# EAGLE design CCM_0001 (EAGLE 6.5.0)
Unipolar (6 wire) stepper motor driver

## Sheet 1 of 6: PIC
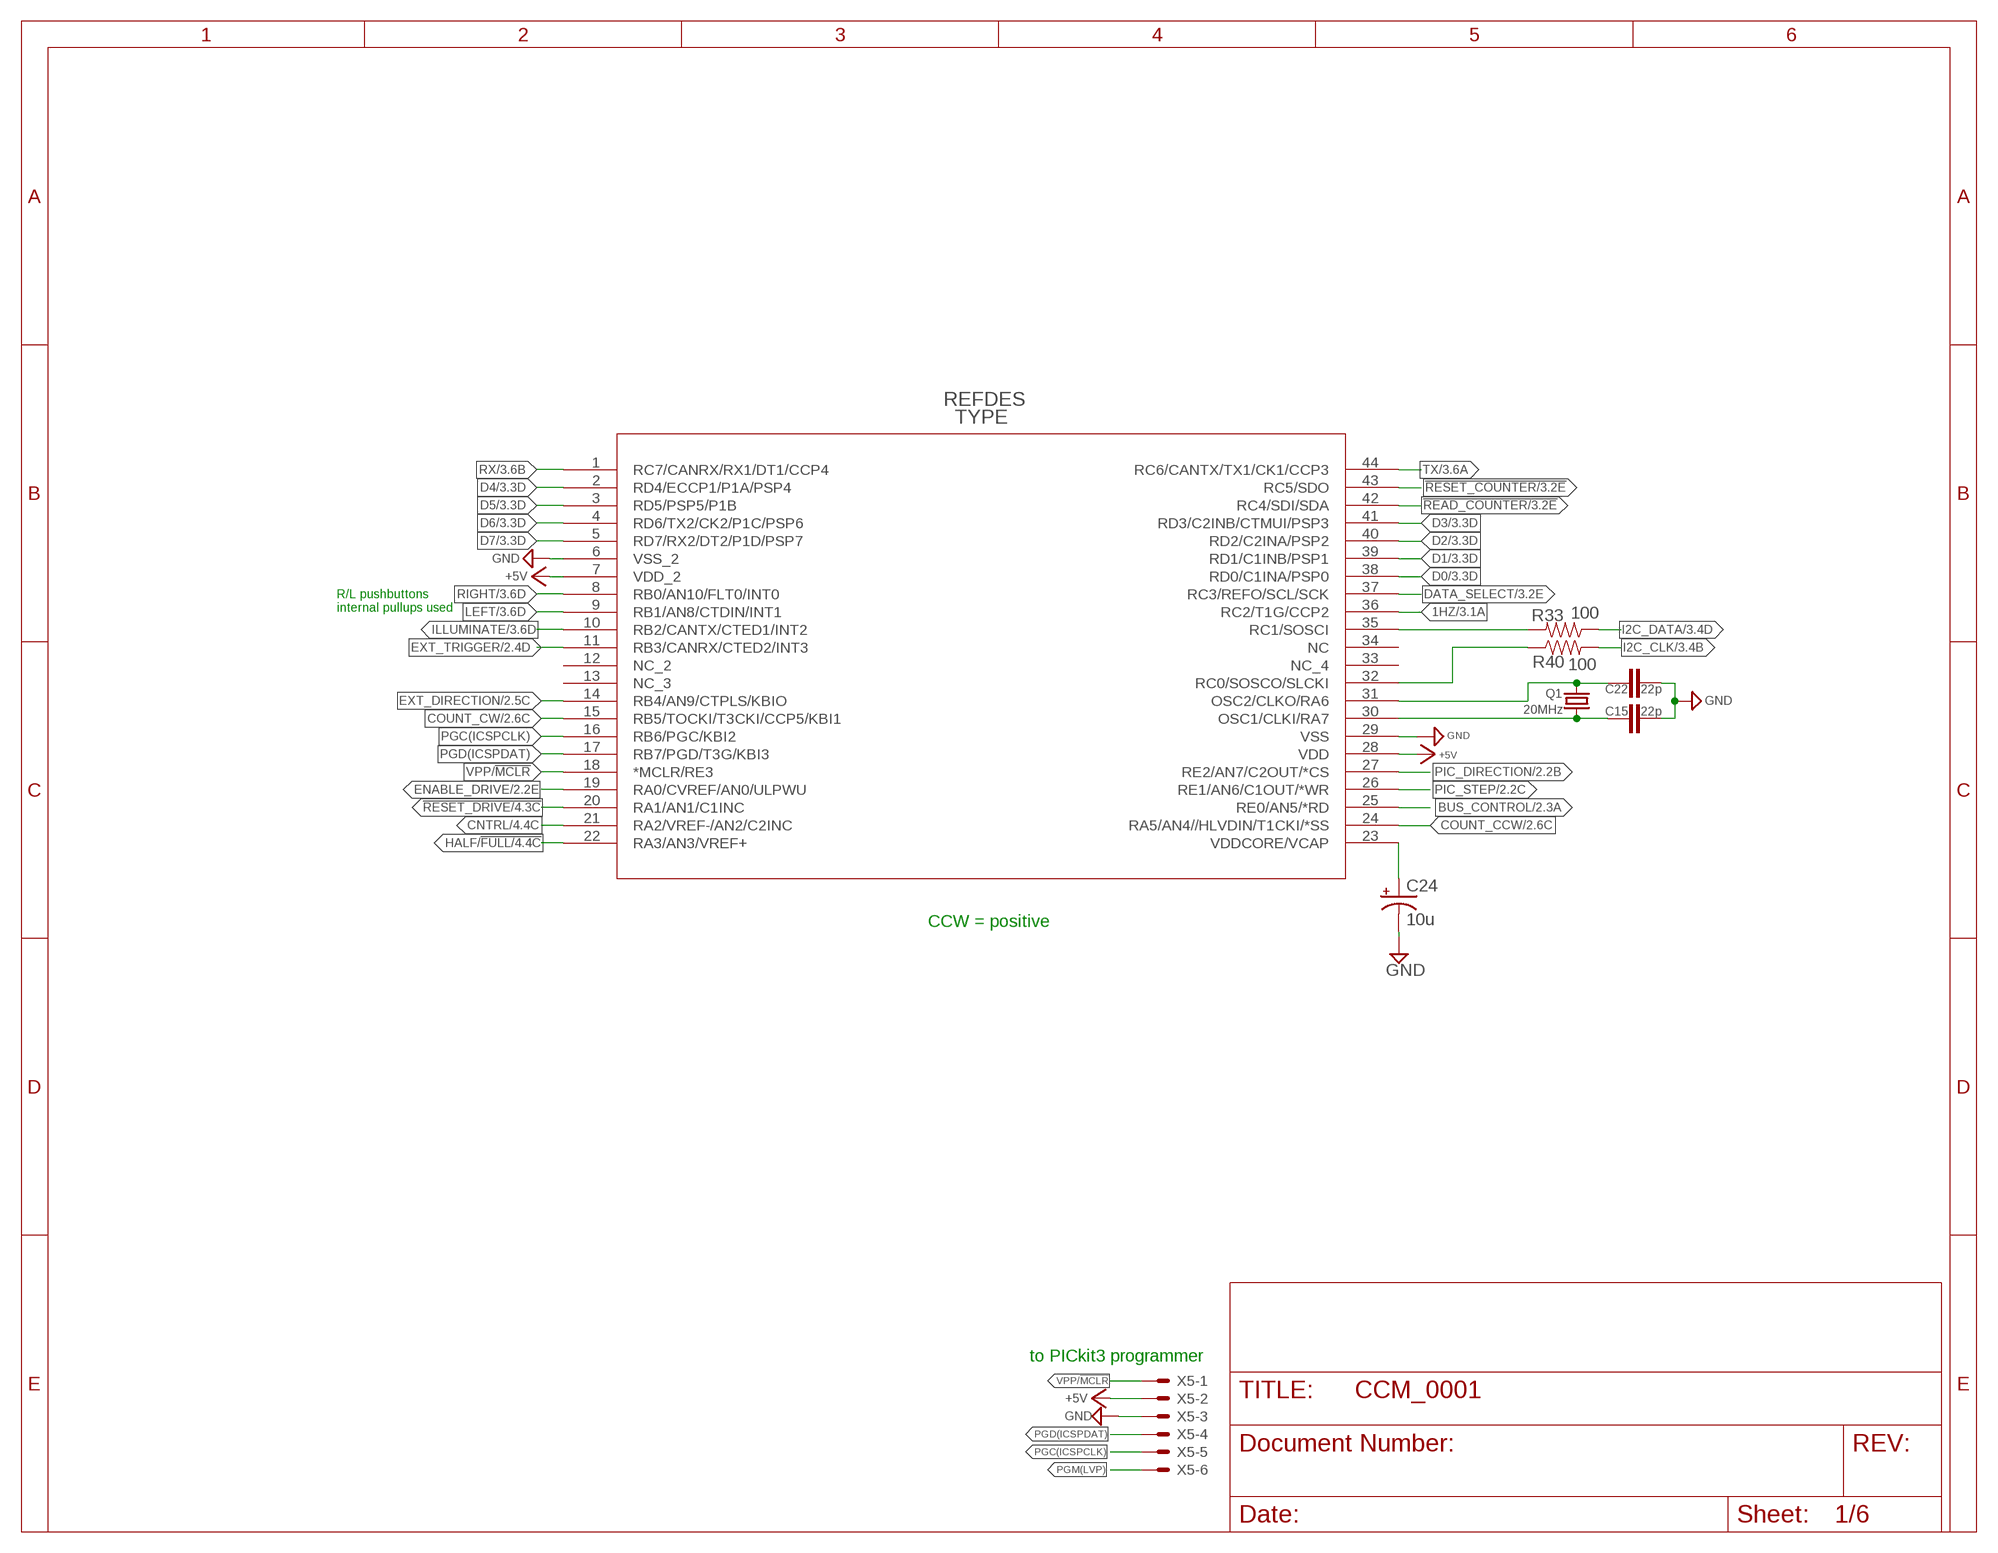
[diagram p0: schematic, sheet 1]

### Parts
C15  22p  CAP0603-CAP  [0603-CAP]
C22  22p  CAP0603-CAP  [0603-CAP]
C24  10u  CAP_POL1206  [EIA3216]
IC18  PIC18F46K80  [TQFP44_MC]
Q1  20MHz  CRYSTALTC26V  [TC26V]
R33  100  RESISTOR0603-RES  [0603-RES]
R40  100  RESISTOR0603-RES  [0603-RES]
X5  22-23-2061  [22-23-2061]

### Nets
1HZ: IC18.36(RC2/T1G/CCP2) ; also sheet 3
!READ_COUNTER: IC18.42(RC4/SDI/SDA) ; also sheet 3
!RESET_COUNTER: IC18.43(RC5/SDO) ; also sheet 3
!RESET_DRIVE: IC18.20(RA1/AN1/C1INC) ; also sheet 4
+5V: IC18.7(VDD_2) IC18.28(VDD) X5.2 ; also sheet 2,3,4,6
BUS_CONTROL: IC18.25(RE0/AN5/*RD) ; also sheet 2
CNTRL: IC18.21(RA2/VREF-/AN2/C2INC) ; also sheet 4
COUNT_CCW: IC18.24(RA5/AN4//HLVDIN/T1CKI/*SS) ; also sheet 2
COUNT_CW: IC18.15(RB5/TOCKI/T3CKI/CCP5/KBI1) ; also sheet 2
D0: IC18.38(RD0/C1INA/PSP0) ; also sheet 3
D1: IC18.39(RD1/C1INB/PSP1) ; also sheet 3
D2: IC18.40(RD2/C2INA/PSP2) ; also sheet 3
D3: IC18.41(RD3/C2INB/CTMUI/PSP3) ; also sheet 3
D4: IC18.2(RD4/ECCP1/P1A/PSP4) ; also sheet 3
D5: IC18.3(RD5/PSP5/P1B) ; also sheet 3
D6: IC18.4(RD6/TX2/CK2/P1C/PSP6) ; also sheet 3
D7: IC18.5(RD7/RX2/DT2/P1D/PSP7) ; also sheet 3
DATA_SELECT: IC18.37(RC3/REFO/SCL/SCK) ; also sheet 3
ENABLE_DRIVE: IC18.19(RA0/CVREF/AN0/ULPWU) ; also sheet 2,4
EXT_DIRECTION: IC18.14(RB4/AN9/CTPLS/KBIO) ; also sheet 2
EXT_TRIGGER: IC18.11(RB3/CANRX/CTED2/INT3) ; also sheet 2
GND: C15.1 C22.1 C24.C(-) IC18.6(VSS_2) IC18.29(VSS) X5.3 ; also sheet 2,3,4,5,6
HALF/!FULL: IC18.22(RA3/AN3/VREF+) ; also sheet 4
I2C_CLK: R40.2 ; also sheet 3
I2C_DATA: R33.1 ; also sheet 3
ILLUMINATE: IC18.10(RB2/CANTX/CTED1/INT2) ; also sheet 3
LEFT: IC18.9(RB1/AN8/CTDIN/INT1) ; also sheet 3
N$4: C15.2 IC18.30(OSC1/CLKI/RA7) Q1.1
N$10: C22.2 IC18.31(OSC2/CLKO/RA6) Q1.2
N$12: C24.A(+) IC18.23(VDDCORE/VCAP)
N$20: IC18.35(RC1/SOSCI) R33.2
N$43: IC18.32(RC0/SOSCO/SLCKI) R40.1
PGC(ICSPCLK): IC18.16(RB6/PGC/KBI2) X5.5
PGD(ICSPDAT): IC18.17(RB7/PGD/T3G/KBI3) X5.4
PGM(LVP): X5.6
PIC_DIRECTION: IC18.27(RE2/AN7/C2OUT/*CS) ; also sheet 2
PIC_STEP: IC18.26(RE1/AN6/C1OUT/*WR) ; also sheet 2
RIGHT: IC18.8(RB0/AN10/FLT0/INT0) ; also sheet 3
RX: IC18.1(RC7/CANRX/RX1/DT1/CCP4) ; also sheet 3
TX: IC18.44(RC6/CANTX/TX1/CK1/CCP3) ; also sheet 3
VPP/!MCLR: IC18.18(*MCLR/RE3) X5.1
Unconnected: IC18.12(NC_2) IC18.13(NC_3) IC18.33(NC_4) IC18.34(NC)

### Notes on the sheet
- R/L pushbuttons
  internal pullups used
- CCW = positive
- to PICkit3 programmer

## Sheet 2 of 6: Inputs/Outputs
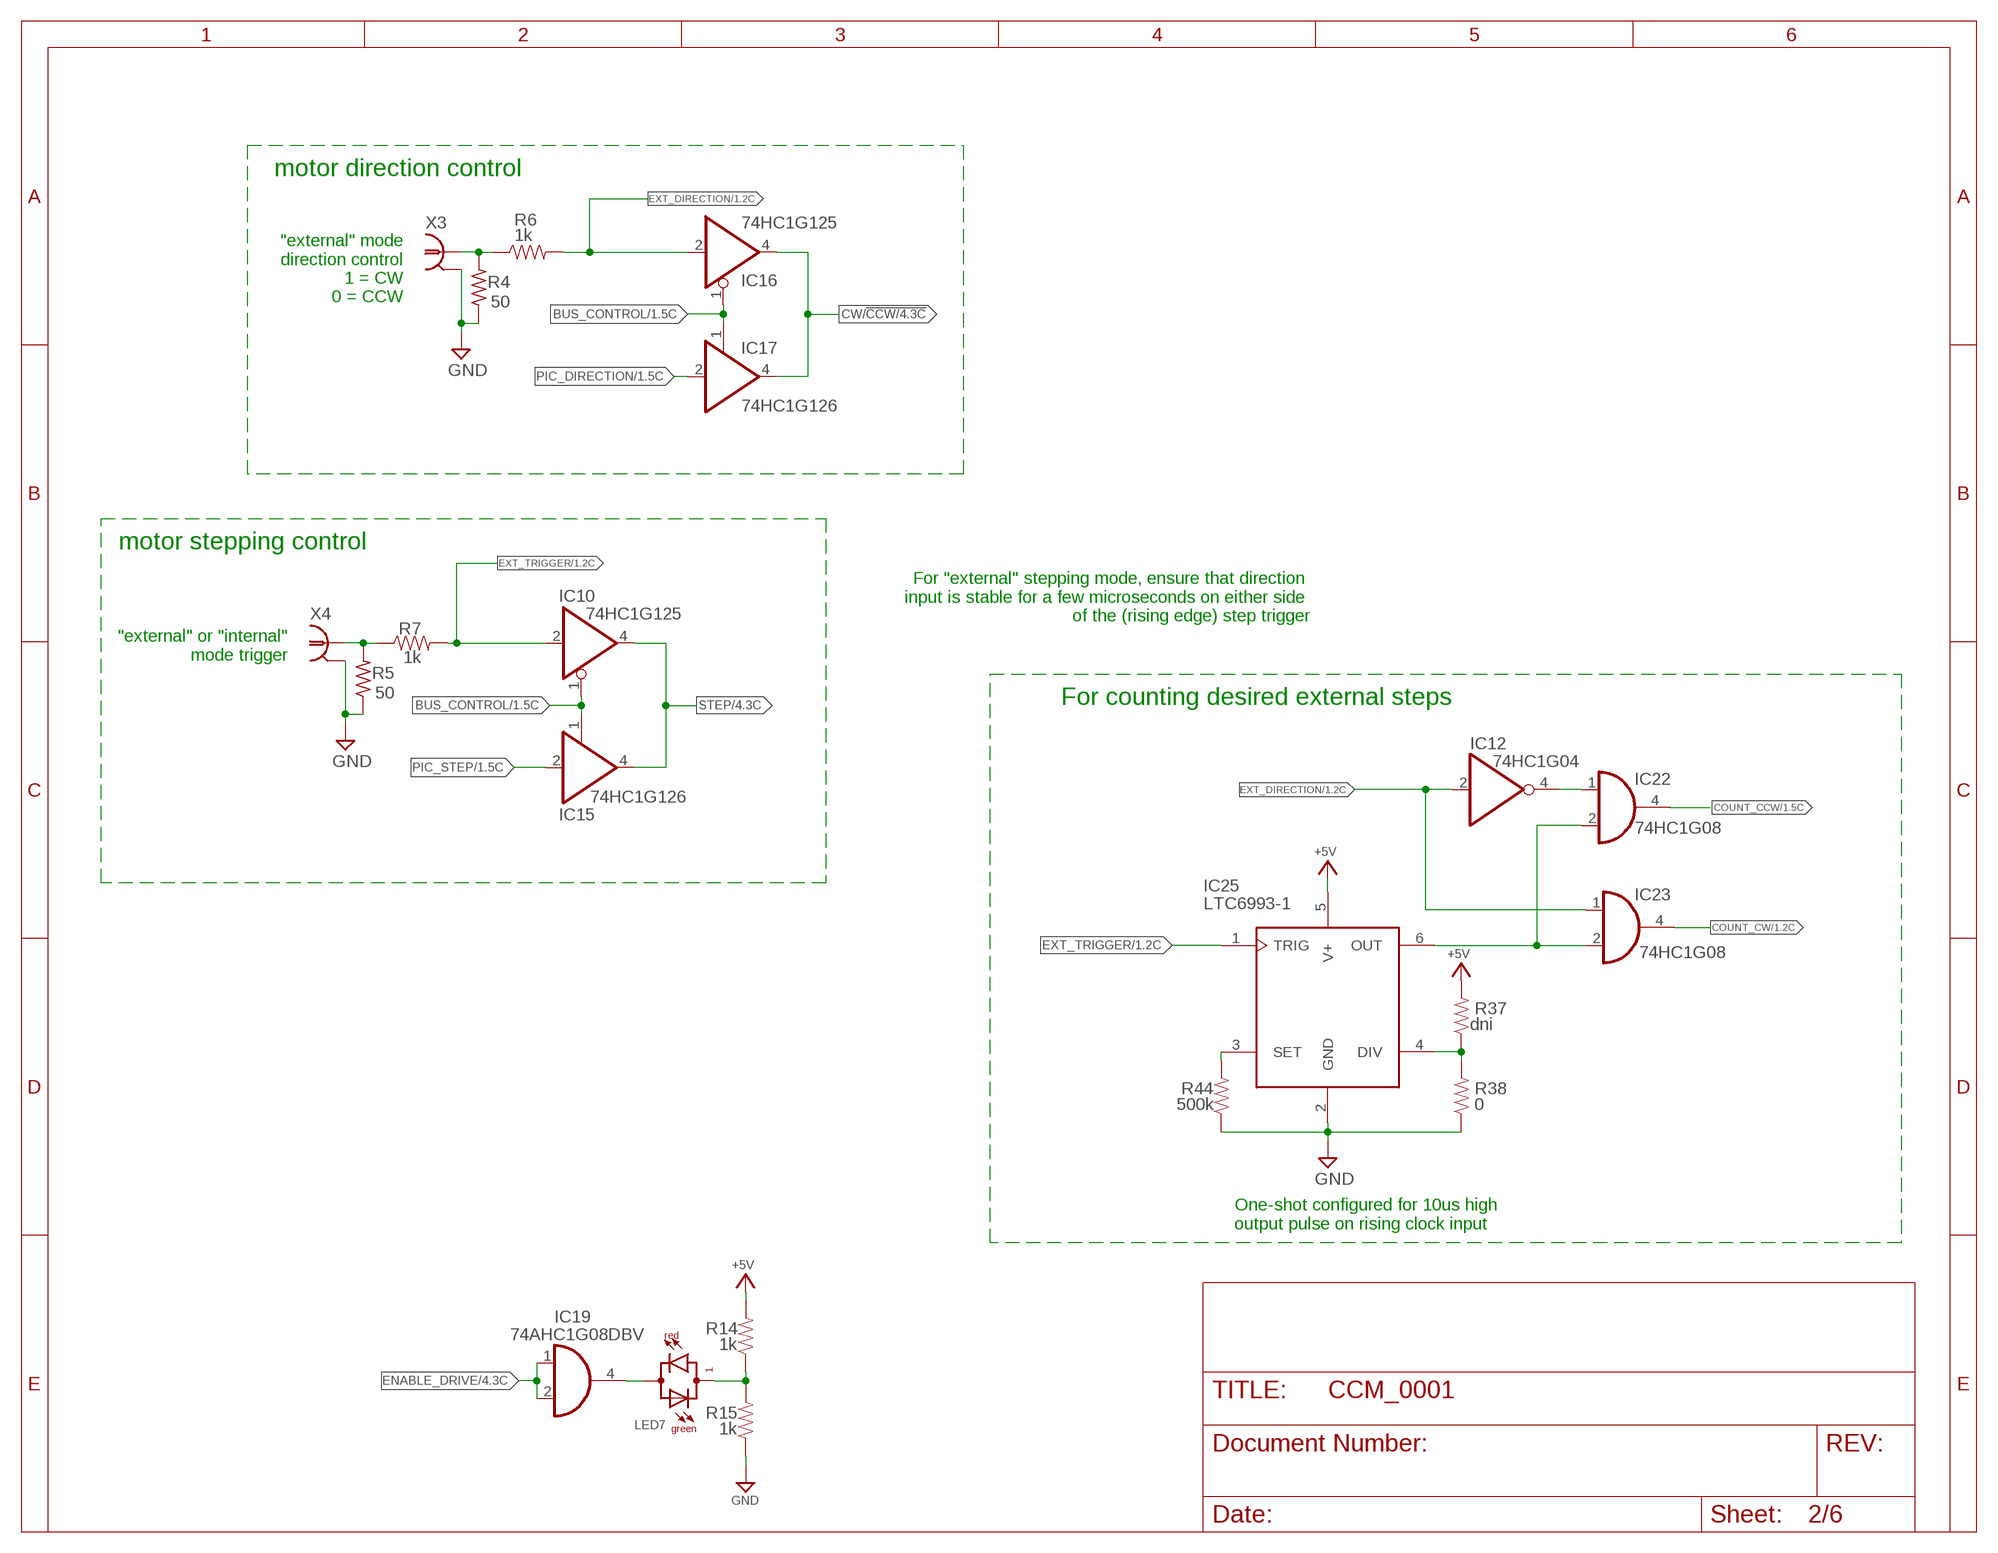
[diagram p1: schematic, sheet 2]

### Parts
IC10  74HC1G125  74AHC1G125DBV  [SOT23-5]
IC12  74HC1G04  74AHC1G04DBV  [SOT23-5]
IC15  74HC1G126  74AHC1G126DBV  [SOT23-5]
IC16  74HC1G125  74AHC1G125DBV  [SOT23-5]
IC17  74HC1G126  74AHC1G126DBV  [SOT23-5]
IC19  74AHC1G08DBV  [SOT23-5]
IC22  74HC1G08  74AHC1G08DBV  [SOT23-5]
IC23  74HC1G08  74AHC1G08DBV  [SOT23-5]
IC25  LTC6993-1  [SOT23-6]
LED7  BILED  [22-23-2021]
R4  50  R-US_R2512  [R2512]
R5  50  R-US_R2512  [R2512]
R6  1k  RESISTOR0603-RES  [0603-RES]
R7  1k  RESISTOR0603-RES  [0603-RES]
R14  1k  RESISTOR0603-RES  [0603-RES]
R15  1k  RESISTOR0603-RES  [0603-RES]
R37  dni  RESISTOR0603-RES  [0603-RES]
R38  0  RESISTOR0603-RES  [0603-RES]
R44  500k  RESISTOR0603-RES  [0603-RES]
X3  1-227161-0  [AMP_227161]
X4  1-227161-0  [AMP_227161]

### Nets
+5V: IC25.5(V+) R14.2 R37.2 ; also sheet 1,3,4,6
BUS_CONTROL: IC10.1(OE) IC15.1(OE) IC16.1(OE) IC17.1(OE) ; also sheet 1
COUNT_CCW: IC22.4(O) ; also sheet 1
COUNT_CW: IC23.4(O) ; also sheet 1
CW/!CCW: IC16.4(O) IC17.4(O) ; also sheet 4
ENABLE_DRIVE: IC19.1(I0) IC19.2(I1) ; also sheet 1,4
EXT_DIRECTION: IC12.2(I) IC16.2(I) IC23.1(I0) R6.2 ; also sheet 1
EXT_TRIGGER: IC10.2(I) IC25.1(TRIG) R7.2 ; also sheet 1
GND: IC25.2(GND) R4.1 R5.1 R15.1 R38.1 R44.1 X3.2 X4.2 ; also sheet 1,3,4,5,6
N$2: R5.2 R7.1 X4.1
N$3: R4.2 R6.1 X3.1
N$30: IC25.4(DIV) R37.1 R38.2
N$47: LED7.1(CG(1)) R14.1 R15.2
N$52: IC19.4(O) LED7.2(CR(2))
N$53: IC25.3(SET) R44.2
N$54: IC12.4(O) IC22.1(I0)
N$101: IC22.2(I1) IC23.2(I1) IC25.6(OUT)
PIC_DIRECTION: IC17.2(I) ; also sheet 1
PIC_STEP: IC15.2(I) ; also sheet 1
STEP: IC10.4(O) IC15.4(O) ; also sheet 4

### Notes on the sheet
- motor direction control
- "external" mode
  direction control
  1 = CW
  0 = CCW
- motor stepping control
- For "external" stepping mode, ensure that direction 
  input is stable for a few microseconds on either side 
  of the (rising edge) step trigger
- "external" or "internal"
  mode trigger
- For counting desired external steps
- One-shot configured for 10us high
  output pulse on rising clock input

## Sheet 3 of 6: Peripheral Devices
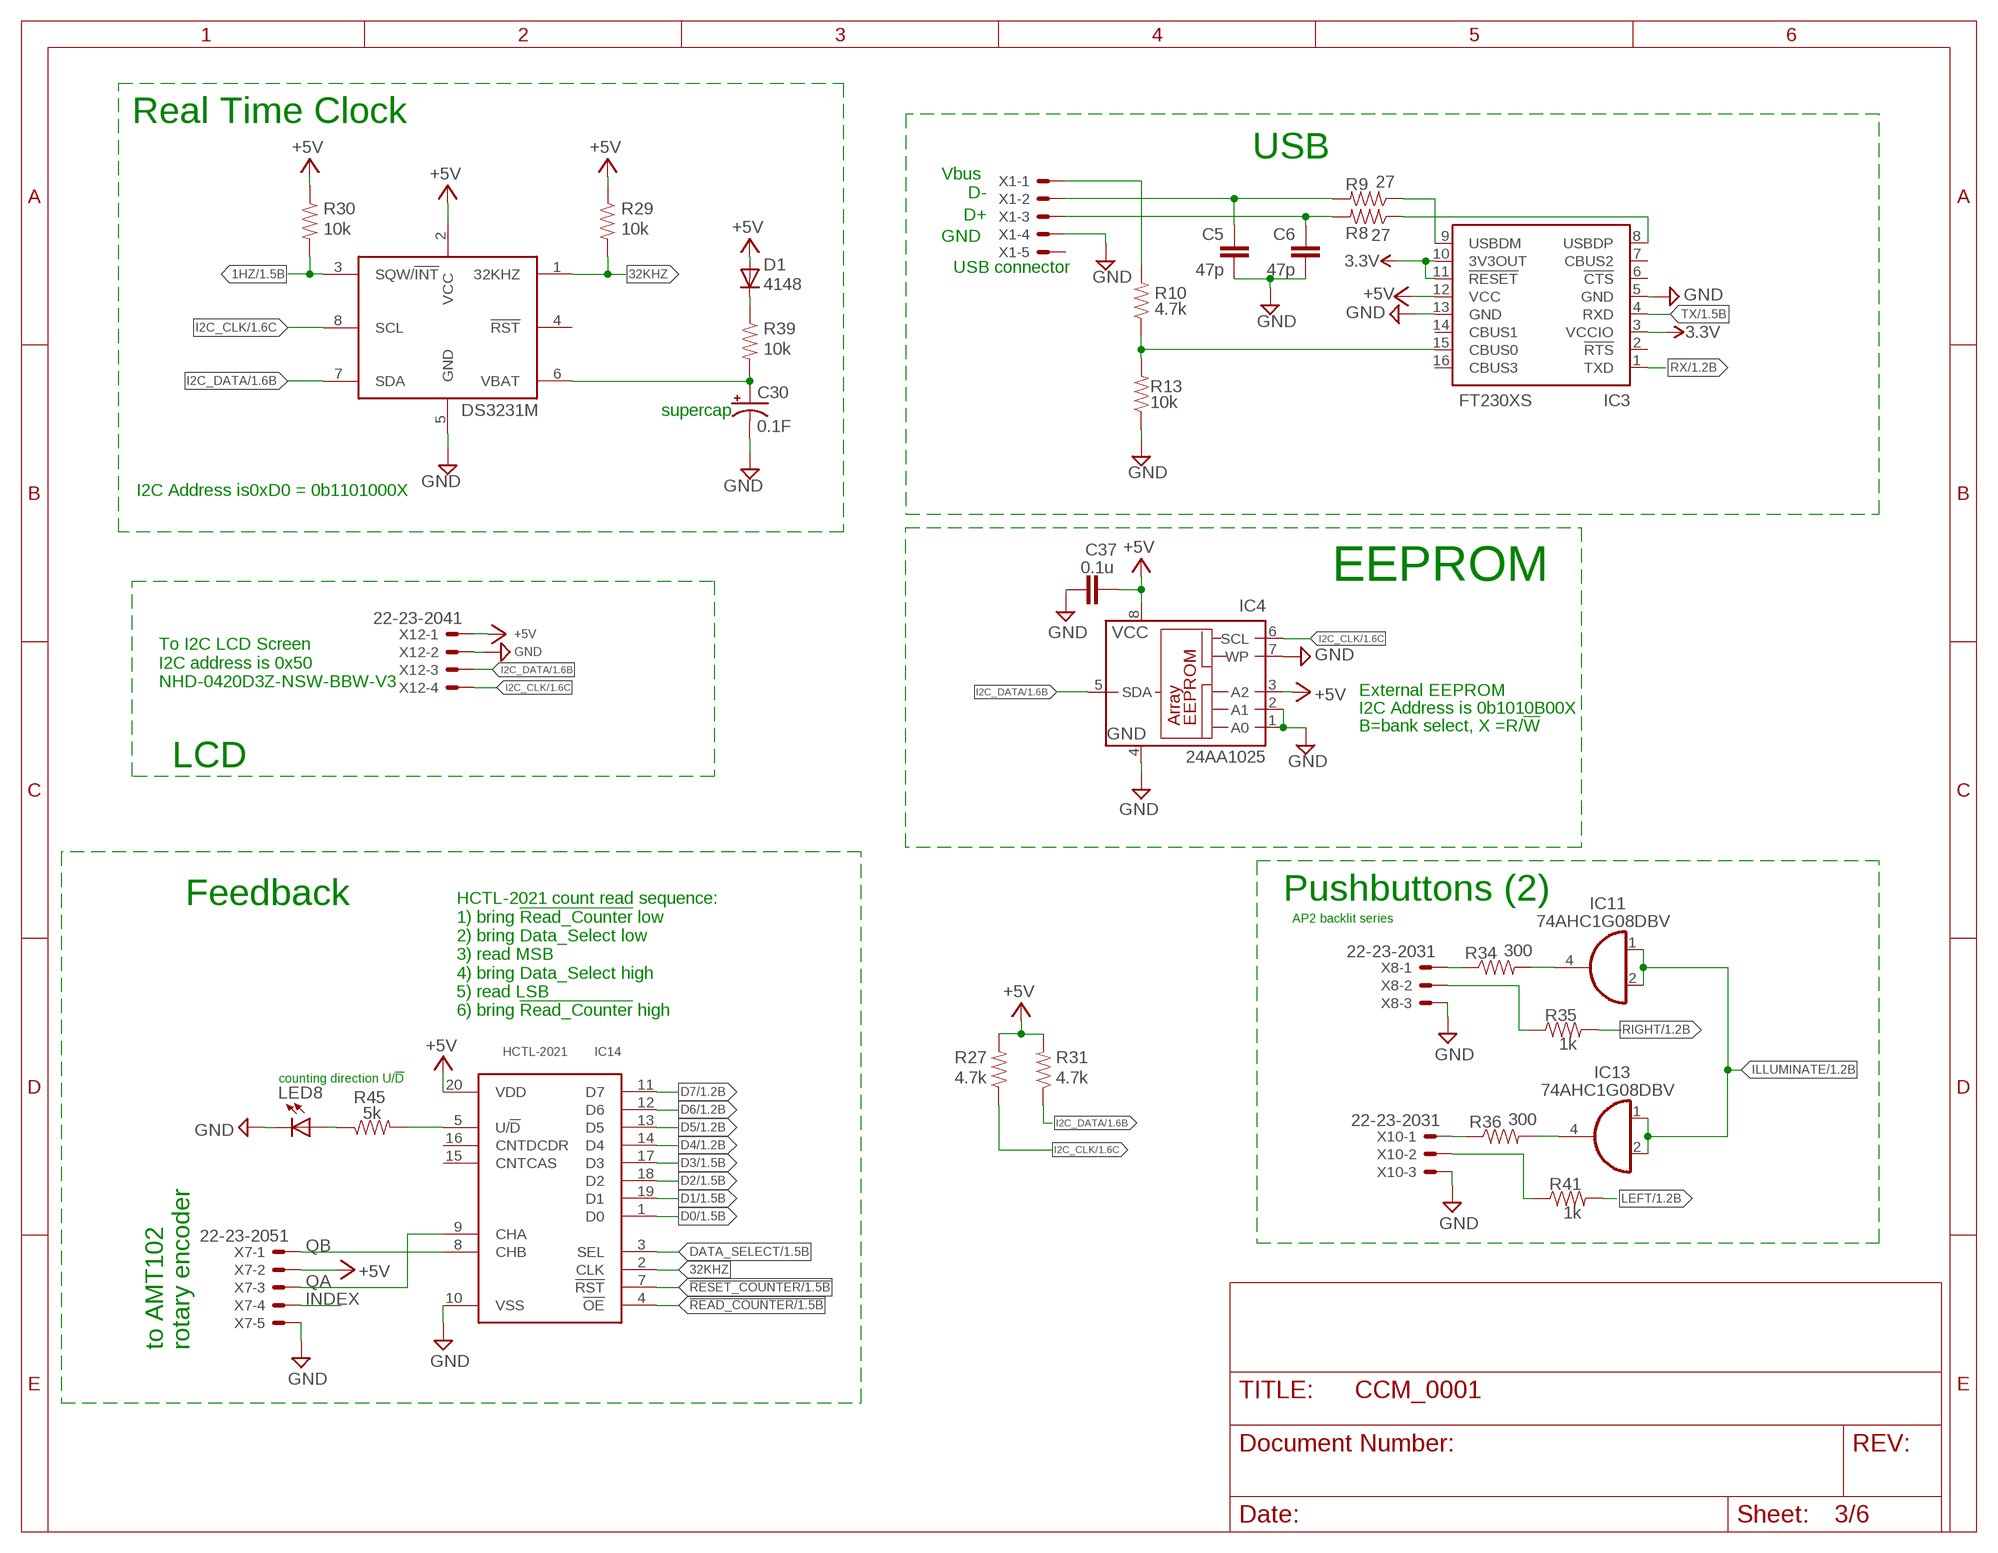
[diagram p2: schematic, sheet 3]

### Parts
C5  47p  CAP0603-CAP  [0603-CAP]
C6  47p  CAP0603-CAP  [0603-CAP]
C30  0.1F  CPOL-USP128-60  [P128-60]
C37  0.1u  CAP0603-CAP  [0603-CAP]
D1  4148  DIODESOT23  [SOT23-3]
IC3  FT230XS  [SSOP16]
IC4  24AA1025  24AA16SN  [SO-08]
IC6  DS3231M  [8-SOIC]
IC11  74AHC1G08DBV  [SOT23-5]
IC13  74AHC1G08DBV  [SOT23-5]
IC14  HCTL-2021  [PLCC20]
LED8  red  LEDCHIPLED_0603  [CHIPLED_0603]
R8  27  RESISTOR0603-RES  [0603-RES]
R9  27  RESISTOR0603-RES  [0603-RES]
R10  4.7k  RESISTOR0603-RES  [0603-RES]
R13  10k  RESISTOR0603-RES  [0603-RES]
R27  4.7k  RESISTOR0603-RES  [0603-RES]
R29  10k  RESISTOR0603-RES  [0603-RES]
R30  10k  RESISTOR0603-RES  [0603-RES]
R31  4.7k  RESISTOR0603-RES  [0603-RES]
R34  300  RESISTOR0603-RES  [0603-RES]
R35  1k  RESISTOR0603-RES  [0603-RES]
R36  300  RESISTOR0603-RES  [0603-RES]
R39  10k  RESISTOR0603-RES  [0603-RES]
R41  1k  RESISTOR0603-RES  [0603-RES]
R45  5k  RESISTOR0603-RES  [0603-RES]
X1  22-23-2051  [22-23-2051]
X7  22-23-2051  [22-23-2051]
X8  22-23-2031  [22-23-2031]
X10  22-23-2031  [22-23-2031]
X12  22-23-2041  [22-23-2041]

### Nets
1HZ: IC6.3(SQW/!INT) R30.2 ; also sheet 1
3.3V: IC3.3(VCCIO) IC3.10(3V3OUT) IC3.11(!RESET) ; also sheet 6
32KHZ: IC6.1(32KHZ) IC14.2(CLK) R29.2
!READ_COUNTER: IC14.4(!OE) ; also sheet 1
!RESET_COUNTER: IC14.7(!RST) ; also sheet 1
+5V: C37.1 D1.1(A) IC3.12(VCC) IC4.3(A2) IC4.8(VCC) IC6.2(VCC) IC14.20(VDD) R27.2 R29.1 R30.1 R31.2 X7.2 X12.1 ; also sheet 1,2,4,6
D0: IC14.1(D0) ; also sheet 1
D1: IC14.19(D1) ; also sheet 1
D2: IC14.18(D2) ; also sheet 1
D3: IC14.17(D3) ; also sheet 1
D4: IC14.14(D4) ; also sheet 1
D5: IC14.13(D5) ; also sheet 1
D6: IC14.12(D6) ; also sheet 1
D7: IC14.11(D7) ; also sheet 1
D+: C6.1 R8.2 X1.3
D-: C5.1 R9.2 X1.2
DATA_SELECT: IC14.3(SEL) ; also sheet 1
GND: C5.2 C6.2 C30.- C37.2 IC3.5(GND) IC3.13(GND) IC4.1(A0) IC4.2(A1) IC4.4(GND) IC4.7(WP) IC6.5(GND) IC14.10(VSS) LED8.C R13.1 X1.4 X7.5 X8.3 X10.3 X12.2 ; also sheet 1,2,4,5,6
I2C_CLK: IC4.6(SCL) IC6.8(SCL) R27.1 X12.4 ; also sheet 1
I2C_DATA: IC4.5(SDA) IC6.7(SDA) R31.1 X12.3 ; also sheet 1
ILLUMINATE: IC11.1(I0) IC11.2(I1) IC13.1(I0) IC13.2(I1) ; also sheet 1
INDEX: X7.4
LEFT: R41.2 ; also sheet 1
N$1: D1.3(C) R39.1
N$6: IC3.9(USBDM) R9.1
N$8: IC3.8(USBDP) R8.1
N$13: IC3.15(CBUS0) R10.1 R13.2
N$15: C30.+ IC6.6(VBAT) R39.2
N$25: R34.1 X8.1
N$38: IC11.4(O) R34.2
N$39: R35.1 X8.2
N$40: R36.1 X10.1
N$41: IC13.4(O) R36.2
N$42: R41.1 X10.2
N$48: LED8.A R45.1
N$49: IC14.5(U/!D) R45.2
QA: IC14.9(CHA) X7.3
QB: IC14.8(CHB) X7.1
RIGHT: R35.2 ; also sheet 1
RX: IC3.1(TXD) ; also sheet 1
TX: IC3.4(RXD) ; also sheet 1
VBUS: R10.2 X1.1
Unconnected: IC3.2(!RTS) IC3.6(!CTS) IC3.7(CBUS2) IC3.14(CBUS1) IC3.16(CBUS3) IC6.4(!RST) IC14.15(CNTCAS) IC14.16(CNTDCDR) X1.5

### Notes on the sheet
- Real Time Clock
- USB
- Vbus
- D-
- D+
- GND
- USB connector
- supercap
- I2C Address is0xD0 = 0b1101000X
- EEPROM
- To I2C LCD Screen
  I2C address is 0x50
  NHD-0420D3Z-NSW-BBW-V3
- External EEPROM
- I2C Address is 0b1010B00X
- B=bank select, X =R/!W
- LCD
- Feedback | Pushbuttons (2)
- AP2 backlit series
- HCTL-2021 count read sequence:
  1) bring !Read_Counter! low
  2) bring Data_Select low 
  3) read MSB
  4) bring Data_Select high
  5) read LSB
  6) bring !Read_Counter! high
- counting direction U/!D!
- to AMT102 
  rotary encoder

## Sheet 4 of 6: Motor Control
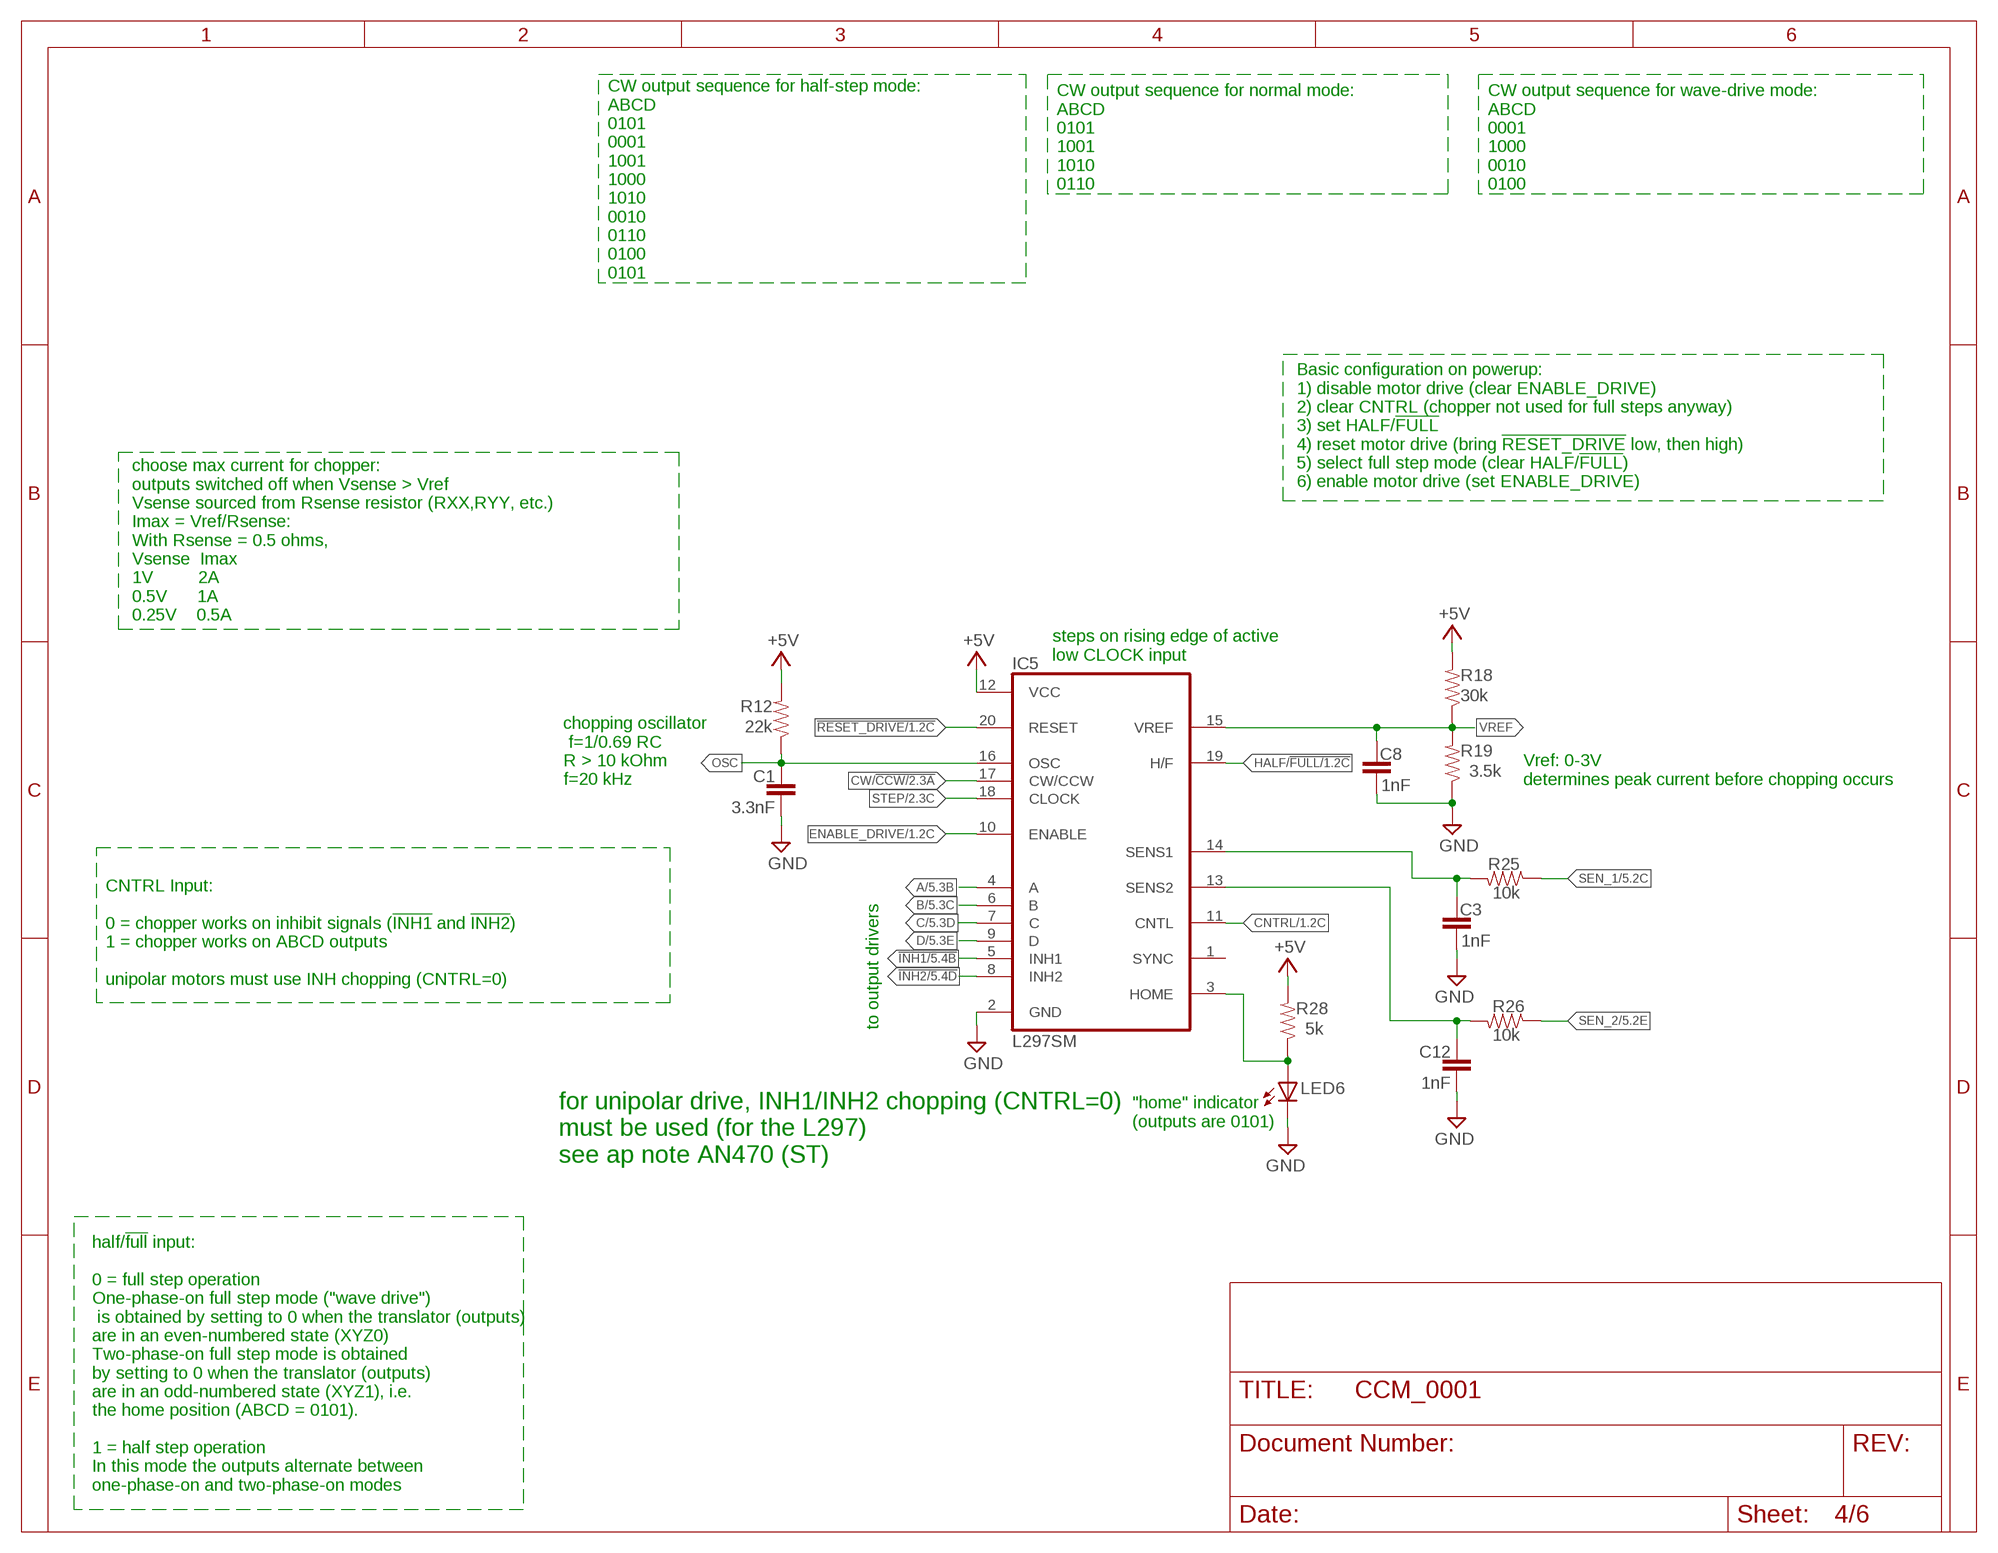
[diagram p3: schematic, sheet 4]

### Parts
C1  3.3nF  CAP0603-CAP  [0603-CAP]
C3  1nF  CAP0603-CAP  [0603-CAP]
C8  1nF  CAP0603-CAP  [0603-CAP]
C12  1nF  CAP0603-CAP  [0603-CAP]
IC5  L297SM  [SO20]
LED6  red  LEDCHIPLED_0603  [CHIPLED_0603]
R12  22k  RESISTOR0603-RES  [0603-RES]
R18  30k  RESISTOR0603-RES  [0603-RES]
R19  3.5k  RESISTOR0603-RES  [0603-RES]
R25  10k  RESISTOR0603-RES  [0603-RES]
R26  10k  RESISTOR0603-RES  [0603-RES]
R28  5k  RESISTOR0603-RES  [0603-RES]

### Nets
!INH1: IC5.5(INH1) ; also sheet 5
!INH2: IC5.8(INH2) ; also sheet 5
!RESET_DRIVE: IC5.20(RESET) ; also sheet 1
+5V: IC5.12(VCC) R12.2 R18.2 R28.2 ; also sheet 1,2,3,6
A: IC5.4(A) ; also sheet 5
B: IC5.6(B) ; also sheet 5
C: IC5.7(C) ; also sheet 5
CNTRL: IC5.11(CNTL) ; also sheet 1
CW/!CCW: IC5.17(CW/CCW) ; also sheet 2
D: IC5.9(D) ; also sheet 5
ENABLE_DRIVE: IC5.10(ENABLE) ; also sheet 1,2
GND: C1.2 C3.2 C8.2 C12.2 IC5.2(GND) LED6.C R19.1 ; also sheet 1,2,3,5,6
HALF/!FULL: IC5.19(H/F) ; also sheet 1
N$23: IC5.3(HOME) LED6.A R28.1
OSC: C1.1 IC5.16(OSC) R12.1
SEN_1: R25.1 ; also sheet 5
SEN_2: R26.1 ; also sheet 5
SENSE1: C3.1 IC5.14(SENS1) R25.2
SENSE2: C12.1 IC5.13(SENS2) R26.2
STEP: IC5.18(CLOCK) ; also sheet 2
VREF: C8.1 IC5.15(VREF) R18.1 R19.2
Unconnected: IC5.1(SYNC)

### Notes on the sheet
- CW output sequence for normal mode:
  ABCD
  0101
  1001
  1010
  0110
- CW output sequence for wave-drive mode:
  ABCD
  0001
  1000
  0010
  0100
- CW output sequence for half-step mode:
  ABCD
  0101
  0001
  1001
  1000
  1010
  0010
  0110
  0100
  0101
- Basic configuration on powerup:
  1) disable motor drive (clear ENABLE_DRIVE)
  2) clear CNTRL (chopper not used for full steps anyway)
  3) set HALF/!FULL!
  4) reset motor drive (bring !RESET_DRIVE! low, then high)
  5) select full step mode (clear HALF/!FULL!)
  6) enable motor drive (set ENABLE_DRIVE)
- choose max current for chopper:
  outputs switched off when Vsense > Vref
  Vsense sourced from Rsense resistor (RXX,RYY, etc.)
  Imax = Vref/Rsense:
  With Rsense = 0.5 ohms,
  Vsense  Imax
  1V         2A
  0.5V      1A
  0.25V    0.5A
- steps on rising edge of active
  low CLOCK input
- chopping oscillator
   f=1/0.69 RC
  R > 10 kOhm
  f=20 kHz
- Vref: 0-3V
  determines peak current before chopping occurs
- CNTRL Input:
  
  0 = chopper works on inhibit signals (!INH1! and !INH2!)
  1 = chopper works on ABCD outputs
  
  unipolar motors must use INH chopping (CNTRL=0)
- to output drivers
- "home" indicator
  (outputs are 0101)
- for unipolar drive, INH1/INH2 chopping (CNTRL=0)
  must be used (for the L297)
  see ap note AN470 (ST)
- half/!full! input:
  
  0 = full step operation
  One-phase-on full step mode ("wave drive")
   is obtained by setting to 0 when the translator (outputs) 
  are in an even-numbered state (XYZ0)
  Two-phase-on full step mode is obtained 
  by setting to 0 when the translator (outputs) 
  are in an odd-numbered state (XYZ1), i.e. 
  the home position (ABCD = 0101).
  
  1 = half step operation
  In this mode the outputs alternate between 
  one-phase-on and two-phase-on modes

## Sheet 5 of 6: Output Drive
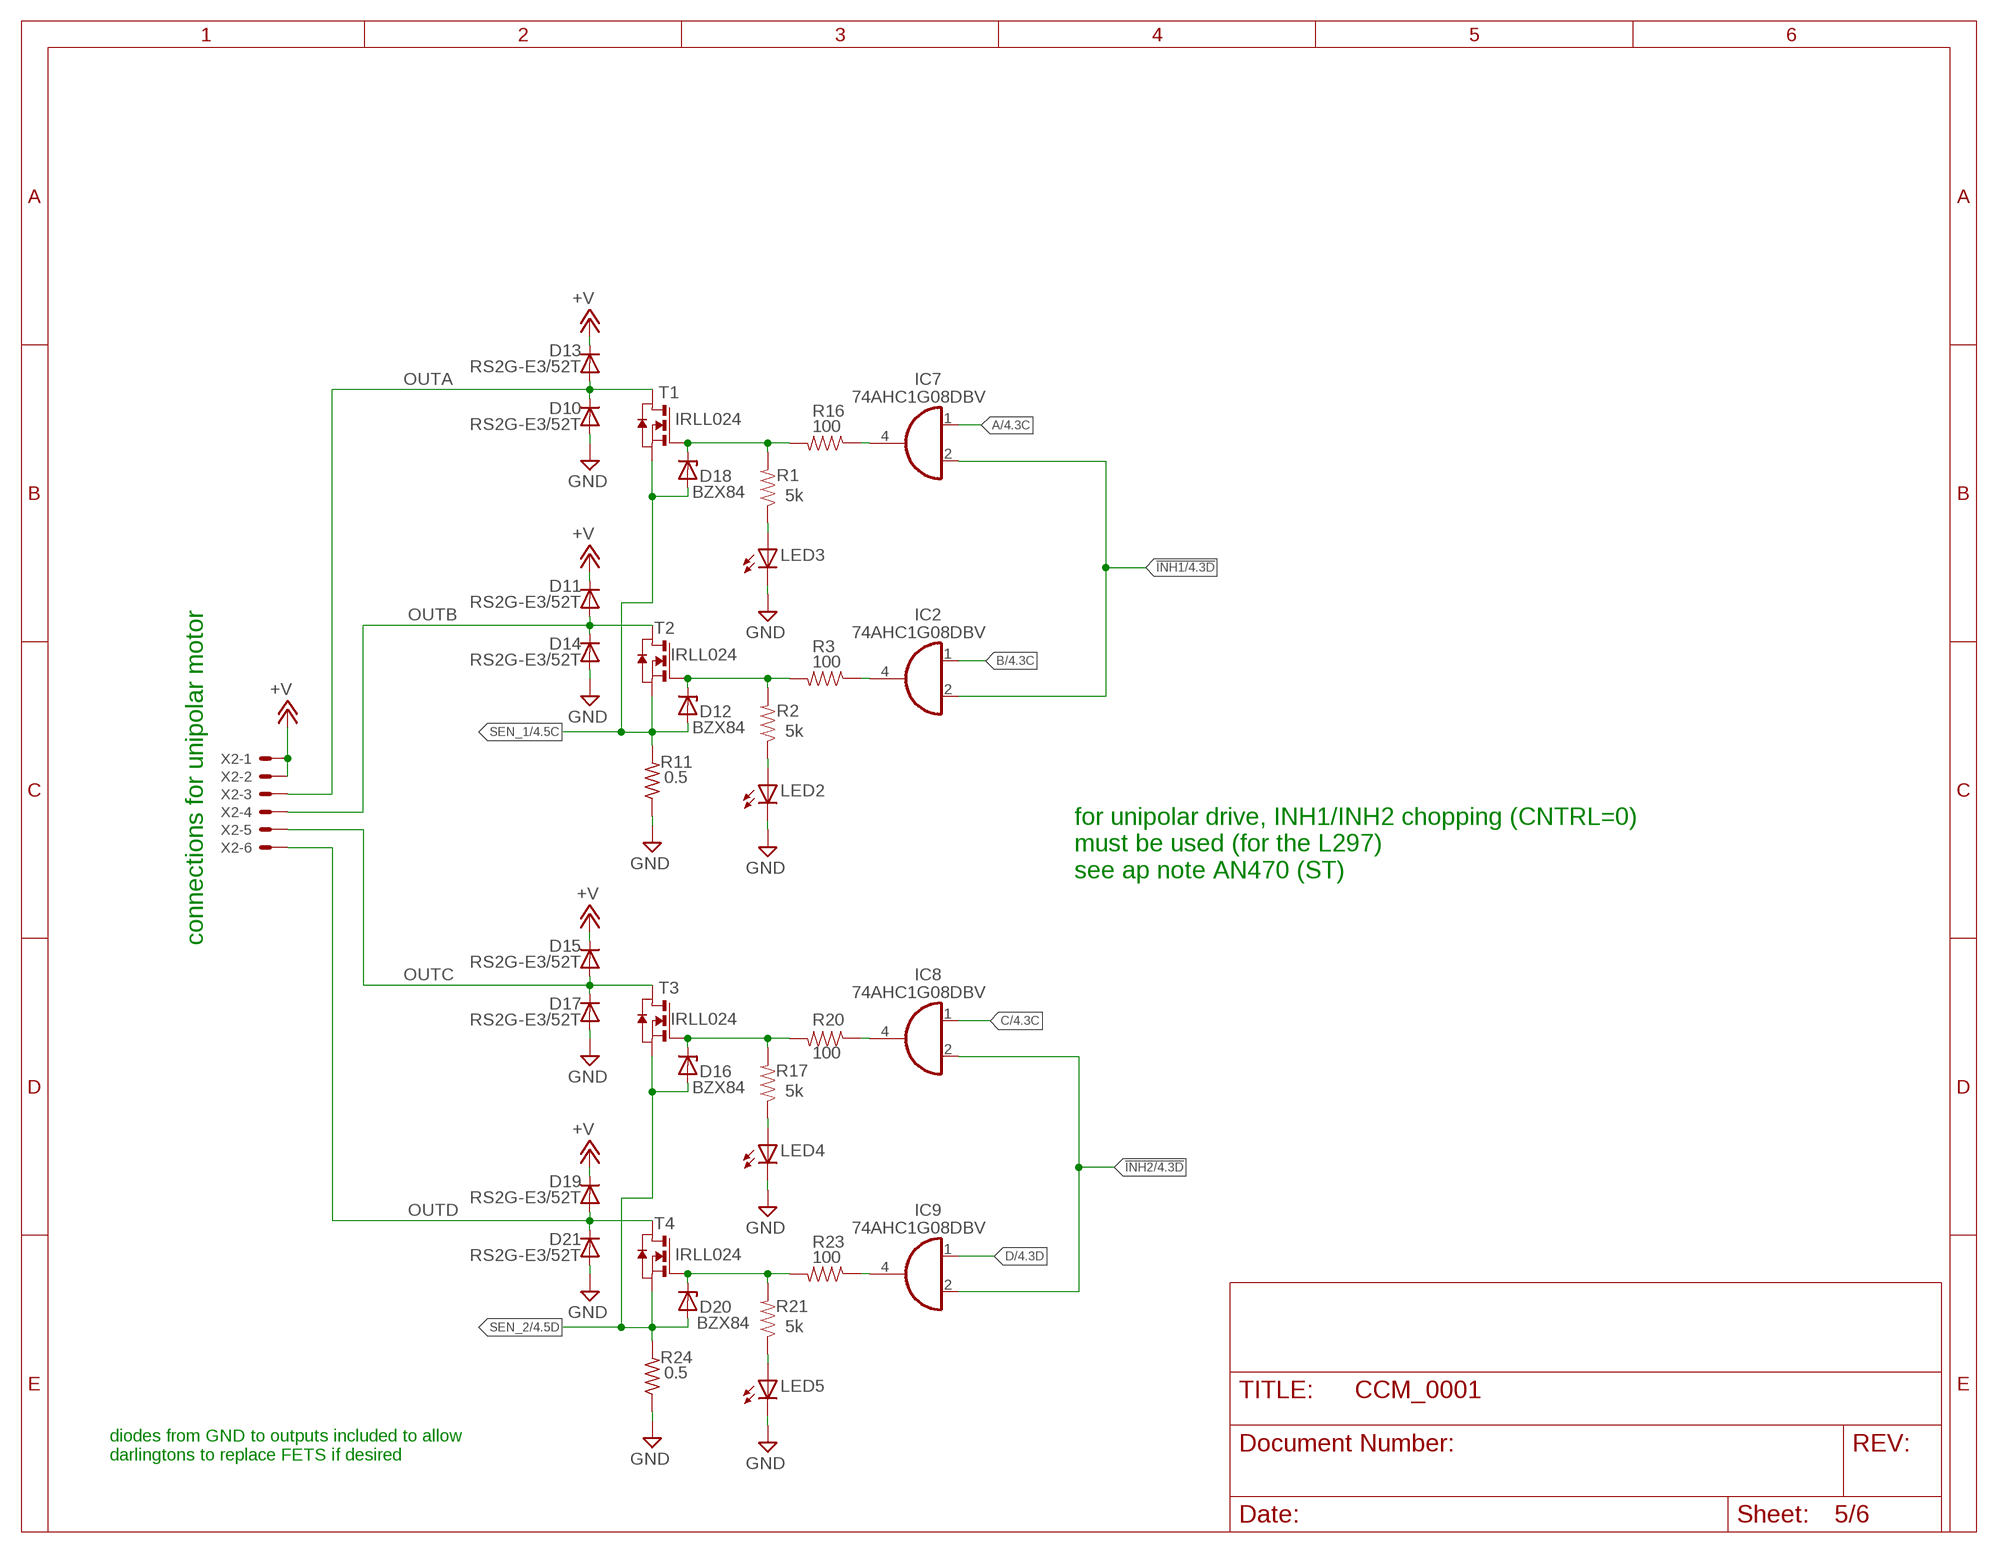
[diagram p4: schematic, sheet 5]

### Parts
D10  RS2G-E3/52T  DIODE-DO214AA  [DO214AA]
D11  RS2G-E3/52T  DIODE-DO214AA  [DO214AA]
D12  BZX84  ZENER-DIODESOT23  [SOT23]
D13  RS2G-E3/52T  DIODE-DO214AA  [DO214AA]
D14  RS2G-E3/52T  DIODE-DO214AA  [DO214AA]
D15  RS2G-E3/52T  DIODE-DO214AA  [DO214AA]
D16  BZX84  ZENER-DIODESOT23  [SOT23]
D17  RS2G-E3/52T  DIODE-DO214AA  [DO214AA]
D18  BZX84  ZENER-DIODESOT23  [SOT23]
D19  RS2G-E3/52T  DIODE-DO214AA  [DO214AA]
D20  BZX84  ZENER-DIODESOT23  [SOT23]
D21  RS2G-E3/52T  DIODE-DO214AA  [DO214AA]
IC2  74AHC1G08DBV  [SOT23-5]
IC7  74AHC1G08DBV  [SOT23-5]
IC8  74AHC1G08DBV  [SOT23-5]
IC9  74AHC1G08DBV  [SOT23-5]
LED2  red  LEDCHIPLED_0603  [CHIPLED_0603]
LED3  red  LEDCHIPLED_0603  [CHIPLED_0603]
LED4  red  LEDCHIPLED_0603  [CHIPLED_0603]
LED5  red  LEDCHIPLED_0603  [CHIPLED_0603]
R1  5k  RESISTOR0603-RES  [0603-RES]
R2  5k  RESISTOR0603-RES  [0603-RES]
R3  100  RESISTOR0603-RES  [0603-RES]
R11  0.5  R-US_R2512  [R2512]
R16  100  RESISTOR0603-RES  [0603-RES]
R17  5k  RESISTOR0603-RES  [0603-RES]
R20  100  RESISTOR0603-RES  [0603-RES]
R21  5k  RESISTOR0603-RES  [0603-RES]
R23  100  RESISTOR0603-RES  [0603-RES]
R24  0.5  R-US_R2512  [R2512]
T1  IRLL024  NMOSSOT223  [SOT223]
T2  IRLL024  NMOSSOT223  [SOT223]
T3  IRLL024  NMOSSOT223  [SOT223]
T4  IRLL024  NMOSSOT223  [SOT223]
X2  22-23-2061  [22-23-2061]

### Nets
!INH1: IC2.2(I1) IC7.2(I1) ; also sheet 4
!INH2: IC8.2(I1) IC9.2(I1) ; also sheet 4
+V: D11.C D13.C D15.C D19.C X2.1 X2.2 ; also sheet 6
A: IC7.1(I0) ; also sheet 4
B: IC2.1(I0) ; also sheet 4
C: IC8.1(I0) ; also sheet 4
D: IC9.1(I0) ; also sheet 4
GND: D10.A D14.A D17.A D21.A LED2.C LED3.C LED4.C LED5.C R11.1 R24.1 ; also sheet 1,2,3,4,6
N$5: LED2.A R2.1
N$11: D12.3(C) R2.2 R3.2 T2.1(G)
N$14: IC2.4(O) R3.1
N$16: LED4.A R17.1
N$21: D16.3(C) R17.2 R20.2 T3.1(G)
N$22: IC8.4(O) R20.1
N$24: LED5.A R21.1
N$26: D20.3(C) R21.2 R23.2 T4.1(G)
N$27: IC9.4(O) R23.1
N$28: D18.3(C) R1.2 R16.2 T1.1(G)
N$31: LED3.A R1.1
N$33: IC7.4(O) R16.1
OUTA: D10.C D13.A T1.2(D) T1.4(D) X2.3
OUTB: D11.A D14.C T2.2(D) T2.4(D) X2.4
OUTC: D15.A D17.C T3.2(D) T3.4(D) X2.5
OUTD: D19.A D21.C T4.2(D) T4.4(D) X2.6
SEN_1: D12.1(A) D18.1(A) R11.2 T1.3(S) T2.3(S) ; also sheet 4
SEN_2: D16.1(A) D20.1(A) R24.2 T3.3(S) T4.3(S) ; also sheet 4

### Notes on the sheet
- for unipolar drive, INH1/INH2 chopping (CNTRL=0)
  must be used (for the L297)
  see ap note AN470 (ST)
- connections for unipolar motor
- diodes from GND to outputs included to allow 
  darlingtons to replace FETS if desired

## Sheet 6 of 6: Power
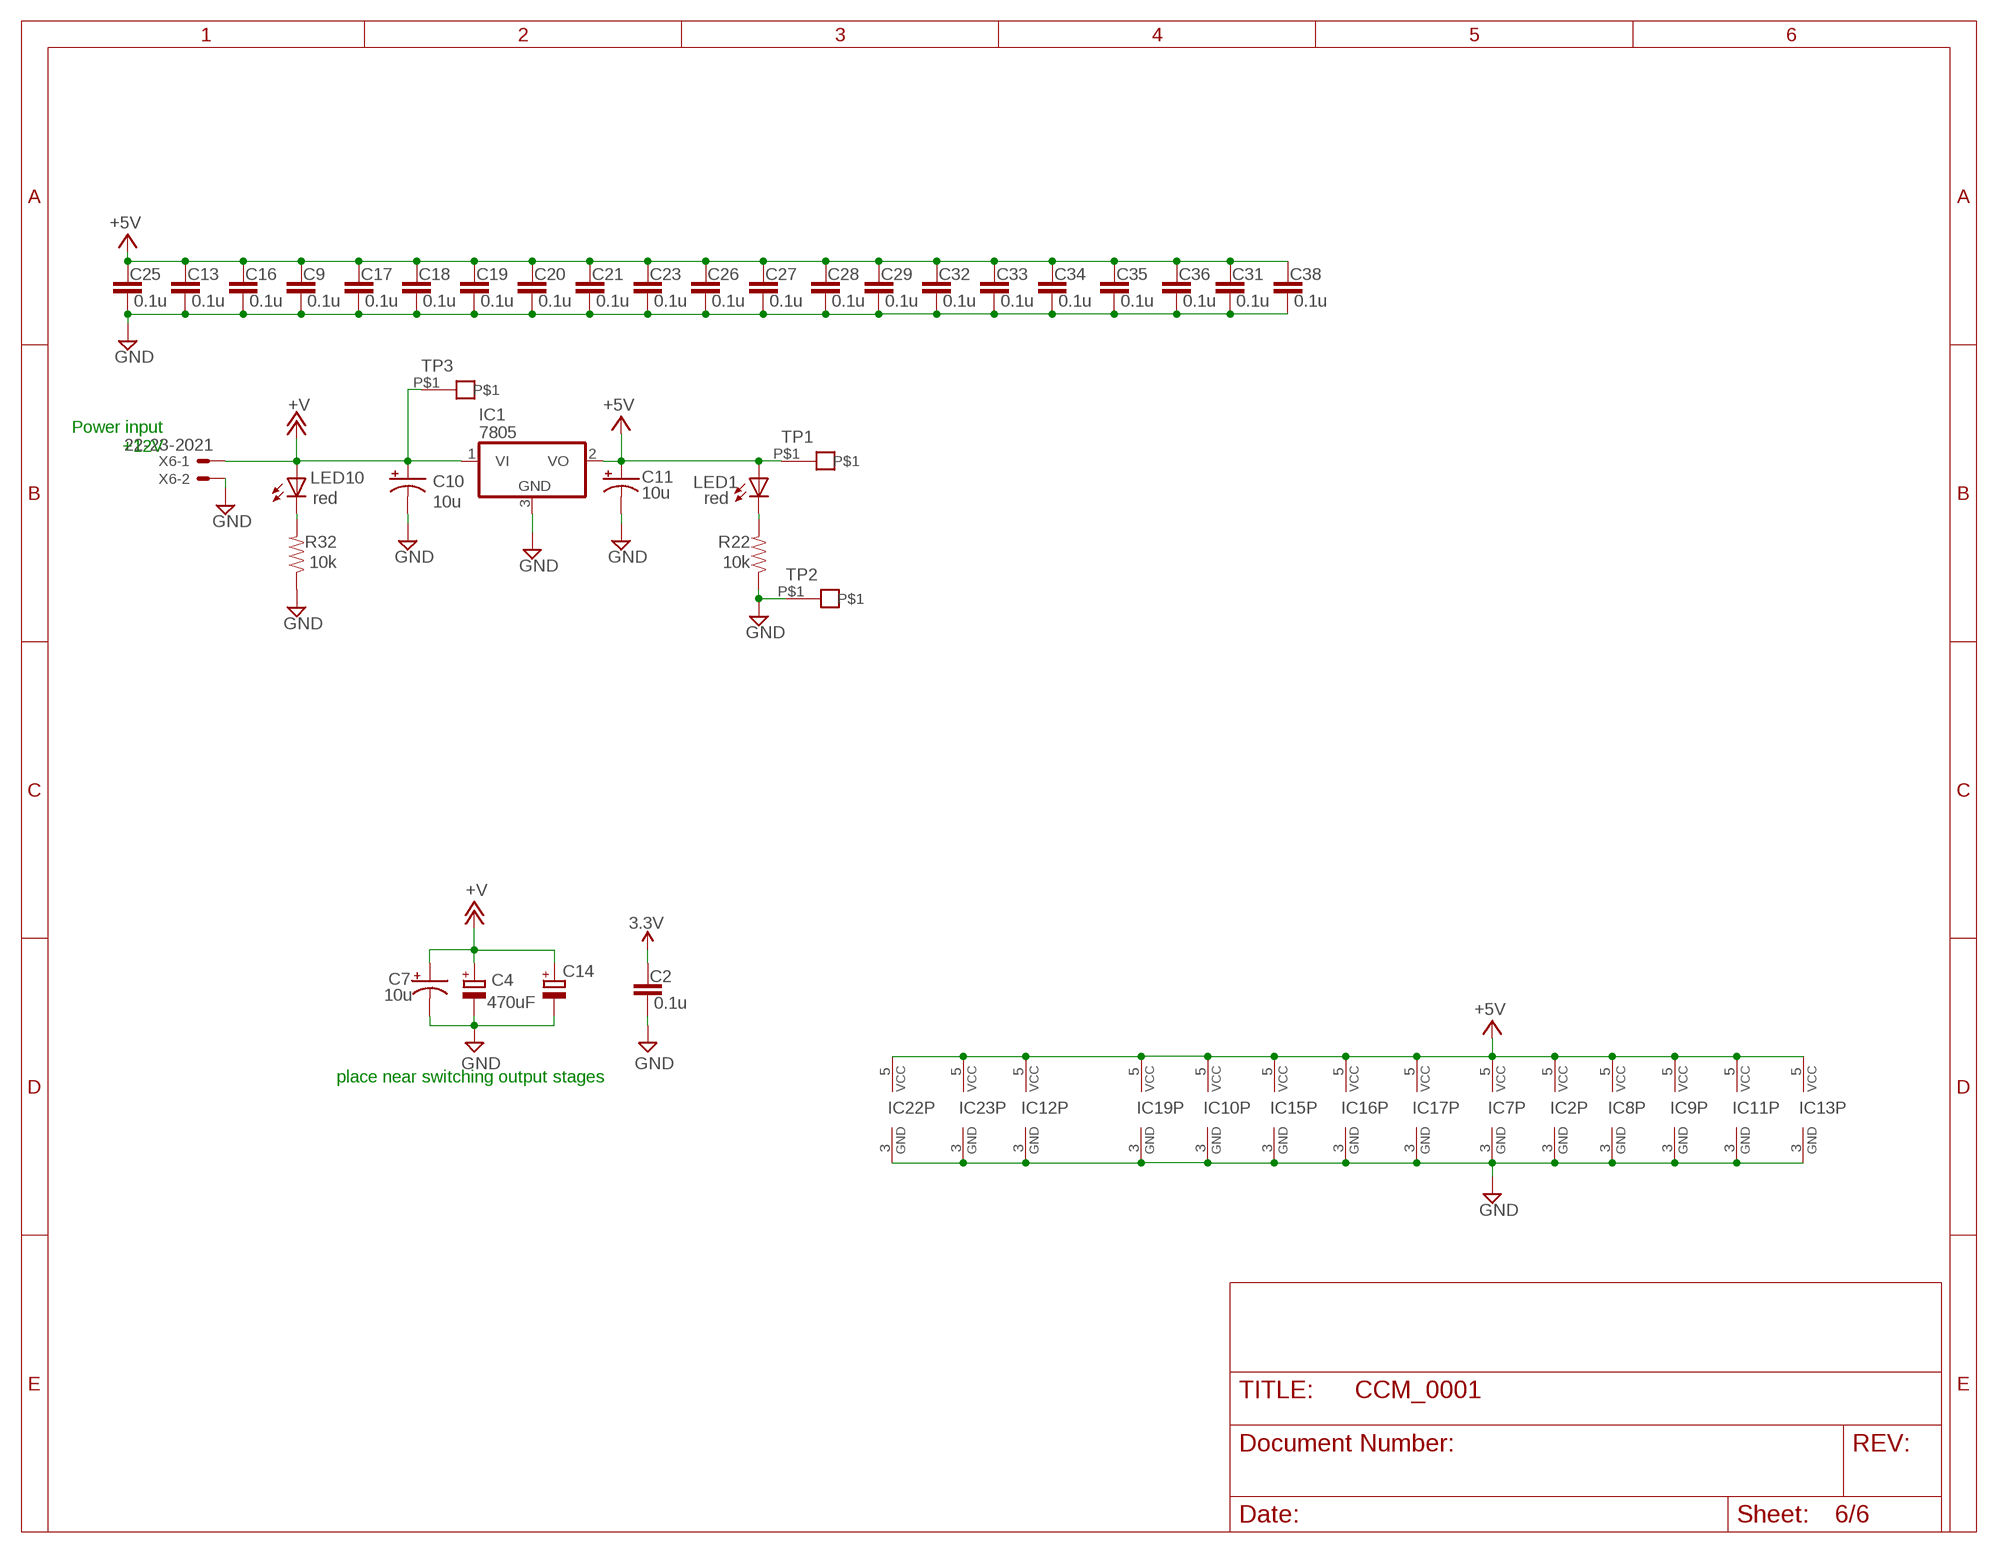
[diagram p5: schematic, sheet 6]

### Parts
C2  0.1u  CAP0603-CAP  [0603-CAP]
C4  470uF  CPOL-EUSANYO_SMD_F8  [SANYO-OSCON_SMD_F8]
C7  10u  CAP_POL1206  [EIA3216]
C9  0.1u  CAP0603-CAP  [0603-CAP]
C10  10u  CAP_POL1206  [EIA3216]
C11  10u  CAP_POL1206  [EIA3216]
C13  0.1u  CAP0603-CAP  [0603-CAP]
C14  CPOL-EUE5-13  [E5-13]
C16  0.1u  CAP0603-CAP  [0603-CAP]
C17  0.1u  CAP0603-CAP  [0603-CAP]
C18  0.1u  CAP0603-CAP  [0603-CAP]
C19  0.1u  CAP0603-CAP  [0603-CAP]
C20  0.1u  CAP0603-CAP  [0603-CAP]
C21  0.1u  CAP0603-CAP  [0603-CAP]
C23  0.1u  CAP0603-CAP  [0603-CAP]
C25  0.1u  CAP0603-CAP  [0603-CAP]
C26  0.1u  CAP0603-CAP  [0603-CAP]
C27  0.1u  CAP0603-CAP  [0603-CAP]
C28  0.1u  CAP0603-CAP  [0603-CAP]
C29  0.1u  CAP0603-CAP  [0603-CAP]
C31  0.1u  CAP0603-CAP  [0603-CAP]
C32  0.1u  CAP0603-CAP  [0603-CAP]
C33  0.1u  CAP0603-CAP  [0603-CAP]
C34  0.1u  CAP0603-CAP  [0603-CAP]
C35  0.1u  CAP0603-CAP  [0603-CAP]
C36  0.1u  CAP0603-CAP  [0603-CAP]
C38  0.1u  CAP0603-CAP  [0603-CAP]
IC1  7805  7824DT  [TO252]
LED1  red  LEDCHIPLED_0603  [CHIPLED_0603]
LED10  red  LEDCHIPLED_0603  [CHIPLED_0603]
R22  10k  RESISTOR0603-RES  [0603-RES]
R32  10k  RESISTOR0603-RES  [0603-RES]
TP1  TESTPOINT  [TESTPOINT]
TP2  TESTPOINT  [TESTPOINT]
TP3  TESTPOINT  [TESTPOINT]
X6  22-23-2021  [22-23-2021]

### Nets
3.3V: C2.1 ; also sheet 3
+5V: C9.1 C11.A(+) C13.1 C16.1 C17.1 C18.1 C19.1 C20.1 C21.1 C23.1 C25.1 C26.1 C27.1 C28.1 C29.1 C31.1 C32.1 C33.1 C34.1 C35.1 C36.1 C38.1 IC1.2(VO) IC2.5(VCC) IC7.5(VCC) IC8.5(VCC) IC9.5(VCC) IC10.5(VCC) IC11.5(VCC) IC12.5(VCC) IC13.5(VCC) IC15.5(VCC) IC16.5(VCC) IC17.5(VCC) IC19.5(VCC) IC22.5(VCC) IC23.5(VCC) LED1.A TP1.P$1 ; also sheet 1,2,3,4
+V: C4.+ C7.A(+) C10.A(+) C14.+ IC1.1(VI) LED10.A TP3.P$1 X6.1 ; supply symbol labelled +12V ; also sheet 5
GND: C2.2 C4.- C7.C(-) C9.2 C10.C(-) C11.C(-) C13.2 C14.- C16.2 C17.2 C18.2 C19.2 C20.2 C21.2 C23.2 C25.2 C26.2 C27.2 C28.2 C29.2 C31.2 C32.2 C33.2 C34.2 C35.2 C36.2 C38.2 IC1.3(GND) IC2.3(GND) IC7.3(GND) IC8.3(GND) IC9.3(GND) IC10.3(GND) IC11.3(GND) IC12.3(GND) IC13.3(GND) IC15.3(GND) IC16.3(GND) IC17.3(GND) IC19.3(GND) IC22.3(GND) IC23.3(GND) R22.1 R32.1 TP2.P$1 X6.2 ; also sheet 1,2,3,4,5
LED1: LED1.C R22.2
LED5: LED10.C R32.2

### Notes on the sheet
- Power input
  +12V
- place near switching output stages

## Library data of the parts
C1-C3 C5 C6 C8 C9 C12 C13 C15-C23 C25-C29 C31-C38 = SparkFun:CAP: Capacitor Standard 0603 ceramic capacitor, and 0.1" leaded capacitor.
C4 = rcl:CPOL-EU: POLARIZED CAPACITOR, European symbol
C7 C10 C11 C24 = SparkFun:CAP_POL: Capacitor Polarized These are standard SMD and PTH capacitors. Normally 10uF, 47uF, and 100uF in electrolytic and tantalum varieties. Always verify the external diameter of the through hole cap, it varies with capacity, voltage, and manufacturer. The EIA devices should be standard.
C14 = resistor:CPOL-EU: POLARIZED CAPACITOR, European symbol
C30 = rcl:CPOL-US: POLARIZED CAPACITOR, American symbol
D1 = SparkFun:DIODE: Diode These are standard reverse protection diodes and small signal diodes. SMA package can handle up to about 1A. SOD-323 can handle about 200mA. What the SOD-323 package when ordering, there are some mfgs out there that are 5-pin packages.
D10 D11 D13-D15 D17 D19 D21 = diode:DIODE-: DIODE
D12 D16 D18 D20 = diode:ZENER-DIODE: Z-Diode
IC1 = linear:78*: Positive VOLTAGE REGULATOR Source: http://cache.national.com/ds/LM/LM78L05.pdf http://www.fairchildsemi.com/ds/LM/LM7805.pdf
IC2 IC7-IC9 IC11 IC13 IC19 IC22 IC23 = 74xx-little-de:74*1G08: 2-input AND gate
IC3 = ftdichip:FT230X: USB to BASIC UART IC Auto generated by make-symbol-device-package-bsdl.ulp Rev. 43 Source: Data sheet <http://www.ftdichip.com/Support/Documents/DataSheets/ICs/DS_FT230X.pdf>
IC4 = microchip:24*: Serial EEPROM I2C; MF: MICROCHIP; MPN: 24AA16-I/SN; OC_FARNELL: 1331289; OC_NEWARK: 96K4056
IC5 = Fitch:L297: STEPPER MOTOR CONTROLLER
IC6 = Fitch_Eagle_Library:DS3231M: RTC (real time clock), I2C communication
IC10 IC16 = 74xx-little-de:74*1G125: Single Bus Buffer Gate with 3-State Output
IC12 = 74xx-little-de:74*1G04: INVERTER Gate
IC14 = Fitch:HCTL-2021: HCTL-2021 Quadrature decoder from Avago Technologies. 20 pin PLC package.
IC15 IC17 = 74xx-little-de:74*1G126: Single Bus Buffer Gate With 3-State Outputs
IC18 = Fitch:PIC18F46K80
IC25 = Fitch:LTC6993-1
LED1-LED6 LED8 LED10 = led:LED: LED OSRAM: - CHIPLED LG R971, LG N971, LY N971, LG Q971, LY Q971, LO R971, LY R971 LH N974, LH R974 LS Q976, LO Q976, LY Q976 LO Q996 - Hyper CHIPLED LW Q18S LB Q993, LB Q99A, LB R99A - SideLED LS A670, LO A670, LY A670, LG A670, LP A670 LB A673, LV A673, LT A673, LW A673 LH A674 LY A675 LS A676, LA A676, LO A676, LY A676, LW A676 LS A679, LY A679, LG A679 - Hyper Micro SIDELED® LS Y876, LA Y876, LO Y876, LY Y876 LT Y87S - SmartLED LW L88C, LW L88S LB L89C, LB L89S, LG L890 LS L89K, LO L89K, LY L89K LS L896, LA L896, LO L896, LY L896 - TOPLED LS T670, LO T670, LY T670, LG T670, LP T670 LSG T670, LSP T670, LSY T670, LOP T670, LYG T670 LG T671, LOG T671, LSG T671 LB T673, LV T673, LT T673, LW T673 LH T674 LS T676, LA T676, LO T676, LY T676, LB T676, LH T676, LSB T676, LW T676 LB T67C, LV T67C, LT T67C, LS T67K, LO T67K, LY T67K, LW E67C LS E67B, LA E67B, LO E67B, LY E67B, LB E67C, LV E67C, LT E67C LW T67C LS T679, LY T679, LG T679 LS T770, LO T770, LY T770, LG T770, LP T770 LB T773, LV T773, LT T773, LW T773 LH T774 LS E675, LA E675, LY E675, LS T675 LS T776, LA T776, LO T776, LY T776, LB T776 LHGB T686 LT T68C, LB T68C - Hyper Mini TOPLED® LB M676 - Mini TOPLED Santana® LG M470 LS M47K, LO M47K, LY M47K Source: http://www.osram.convergy.de LUXEON: - LUMILED® LXK2-PW12-R00, LXK2-PW12-S00, LXK2-PW14-U00, LXK2-PW14-V00 LXK2-PM12-R00, LXK2-PM12-S00, LXK2-PM14-U00 LXK2-PE12-Q00, LXK2-PE12-R00, LXK2-PE12-S00, LXK2-PE14-T00, LXK2-PE14-U00 LXK2-PB12-K00, LXK2-PB12-L00, LXK2-PB12-M00, LXK2-PB14-N00, LXK2-PB14-P00, LXK2-PB14-Q00 LXK2-PR12-L00, LXK2-PR12-M00, LXK2-PR14-Q00, LXK2-PR14-R00 LXK2-PD12-Q00, LXK2-PD12-R00, LXK2-PD12-S00 LXK2-PH12-R00, LXK2-PH12-S00 LXK2-PL12-P00, LXK2-PL12-Q00, LXK2-PL12-R00 Source: www.luxeon.com KINGBRIGHT: KA-3528ASYC Source: www.kingbright.com
LED7 = Fitch:BILED: DUO LED 2 colors (red/green), 5 mm, round, common Anode www.ligitek.com or other producers.
Q1 = crystal:CRYSTAL: CRYSTAL
R1-R3 R6-R10 R12-R23 R25-R41 R44 R45 = SparkFun:RESISTOR: Resistor Basic schematic elements and footprints for 0603, 1206, and PTH 1/10th watt (small) resistors.
R4 R5 = rcl:R-US_: RESISTOR, American symbol
R11 R24 = resistor:R-US_: RESISTOR, American symbol
T1-T4 = zetex:NMOSSOT223: MOS FET; OC_FARNELL: unknown; OC_NEWARK: unknown
TP1-TP3 = Fitch:TESTPOINT
X1 X7 = con-molex:22-23-2051: .100" (2.54mm) Center Header - 5 Pin; MF: MOLEX; MPN: 22-23-2051; OC_FARNELL: 1462952; OC_NEWARK: 38C9178
X2 X5 = con-molex:22-23-2061: .100" (2.54mm) Center Header - 6 Pin; MF: MOLEX; MPN: 22-23-2061; OC_FARNELL: 1462922; OC_NEWARK: 27C1933
X3 X4 = con-coax:?227161*: JACK, RIGHT ANGLE, 50 OHM, PCB, BNC Source: amp_227161.pdf; MF: TYCO ELECTRONICS; MPN: 1-227161; OC_FARNELL: unknown; OC_NEWARK: 33B3200
X6 = con-molex:22-23-2021: .100" (2.54mm) Center Header - 2 Pin; MF: MOLEX; MPN: 22-23-2021; OC_FARNELL: 1462926; OC_NEWARK: 25C3832
X8 X10 = con-molex:22-23-2031: .100" (2.54mm) Center Header - 3 Pin; MF: MOLEX; MPN: 22-23-2031; OC_FARNELL: 1462950; OC_NEWARK: 30C0862
X12 = con-molex:22-23-2041: .100" (2.54mm) Center Header - 4 Pin; MF: MOLEX; MPN: 22-23-2041; OC_FARNELL: 1462920; OC_NEWARK: 38C0355

## Net classes
1 standard: width 0.61 mm, clearance 0.254 mm

## Board
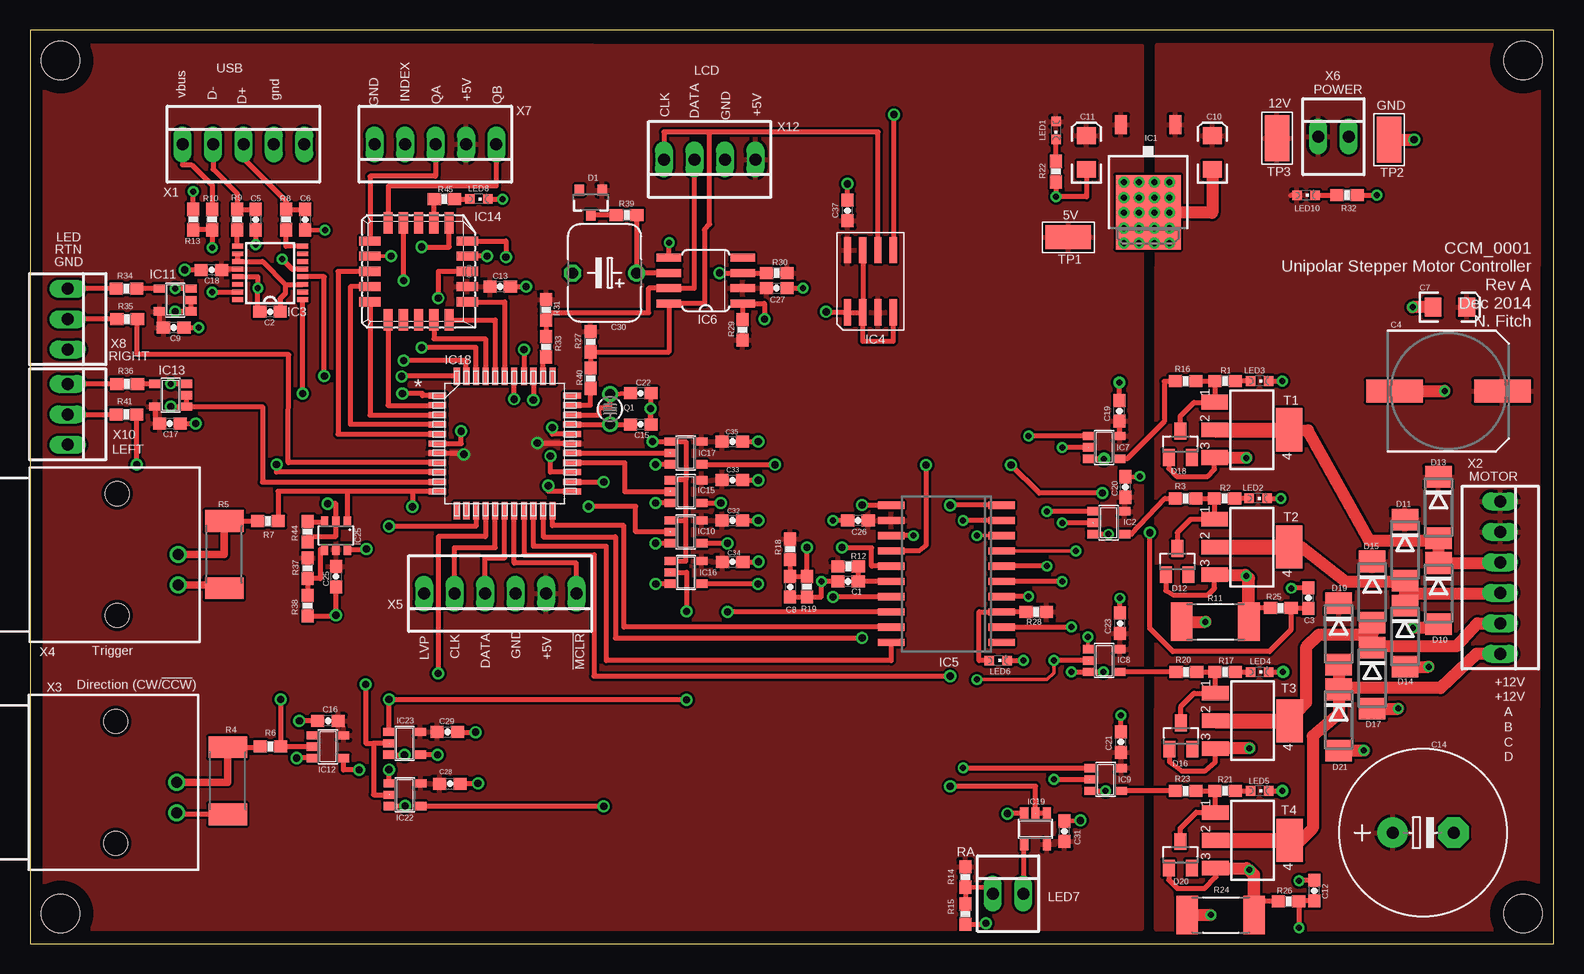
[diagram p6: board, top side]
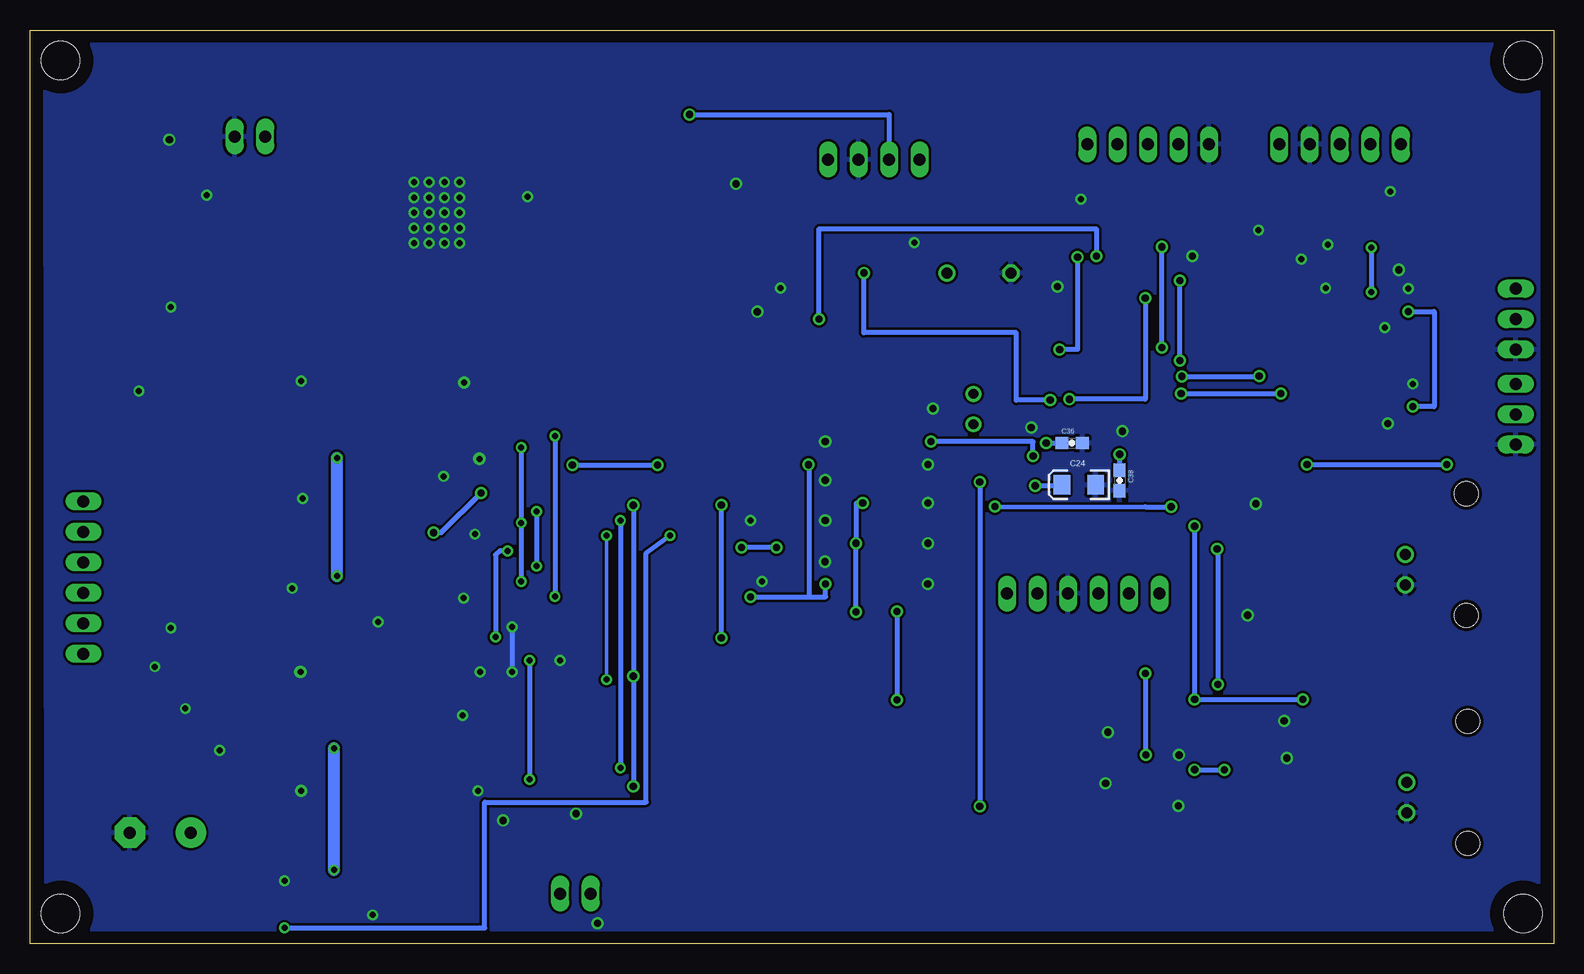
[diagram p7: board, bottom side, seen from below]

Size 127 x 76.2 mm. Coordinates in mm from the lower left corner, seen from the top.
Outline: 0,0 127,0 127,76.2 0,76.2 0,0
Copper layers (1*16): Top 0.035mm / dielectric 2mm / Bottom 0.035mm
Design rules "default *": minimum track width 10mil, minimum drill 19mil, track to track 8mil, track to pad 8mil, pad to pad 8mil, via to via 8mil, smd to smd 8mil, copper to edge 12mil, drill to drill 8mil, minimum pad ring 10mil, minimum via ring 8mil, stop-mask expansion 4mil, vias tented up to drill 0mil, thermal gap 10mil
Holes 3.2 mm at 2.54,2.54 2.54,73.66 124.46,73.66 124.46,2.54
tRestrict: area 123.2,1.3 to 125.7,3.8; area 1.3,1.3 to 3.8,3.8; area 1.3,72.4 to 3.8,74.9; area 123.2,72.4 to 125.7,74.9
bRestrict: area 1.3,72.4 to 3.8,74.9; area 123.2,72.4 to 125.7,74.9; area 123.2,1.3 to 125.7,3.8; area 1.3,1.3 to 3.8,3.8

### Footprints (pad centres in the part's own frame; a part is rotated, then mirrored left to right if it is on the bottom)
0603-CAP = smd 1.1 x 1: 1 -0.85,0; 2 0.85,0
SANYO-OSCON_SMD_F8 = smd 4.7 x 1.9: + 4.5,0; - -4.5,0
EIA3216 = smd 1.4 x 1.6: A 1.4,0; C -1.4,0
E5-13 = drill 1.016 pad 2.54: + -2.54,0 | drill 1.016 pad 2.54 octagon: - 2.54,0
P128-60 = drill 0.914: + -2.667,0 | drill 0.914 octagon: - 2.667,0
SOT23-3 = smd 0.8 x 0.9: 1 -0.95,-1; 2 0.95,-1; 3 0,1.1
DO214AA = smd 1.8 x 2.2: A 2.55,0; C -2.55,0
SOT23 = smd 1 x 1.4: 1 -0.95,-1.1; 2 0.95,-1.1; 3 0,1.1
TO252 = smd 1 x 1.6: 1 -2.28,-4.8; 2 2.28,-4.8 | smd 5.4 x 6.2: 3 0,2.5
SOT23-5 = smd 0.69 x 0.99: 1 -0.95,-1.29; 2 0,-1.29; 3 0.95,-1.29; 4 0.95,1.3; 5 -0.95,1.3
SSOP16 = smd 0.914 x 0.406: 1 -2.718,2.223; 2 -2.718,1.587; 3 -2.718,0.953; 4 -2.718,0.318; 5 -2.718,-0.318; 6 -2.718,-0.953; 7 -2.718,-1.587; 8 -2.718,-2.223; 9 2.718,-2.223; 10 2.718,-1.587; 11 2.718,-0.953; 12 2.718,-0.318; 13 2.718,0.318; 14 2.718,0.953; 15 2.718,1.587; 16 2.718,2.223
SO-08 = smd 0.6 x 2.2: 1 -1.905,-2.6; 2 -0.635,-2.6; 3 0.635,-2.6; 4 1.905,-2.6; 5 1.905,2.6; 6 0.635,2.6; 7 -0.635,2.6; 8 -1.905,2.6
SO20 = smd 0.6 x 2.2: 1 -5.715,-4.6; 2 -4.445,-4.6; 3 -3.175,-4.6; 4 -1.905,-4.6; 5 -0.635,-4.6; 6 0.635,-4.6; 7 1.905,-4.6; 8 3.175,-4.6; 9 4.445,-4.6; 10 5.715,-4.6; 11 5.715,4.6; 12 4.445,4.6; 13 3.175,4.6; 14 1.905,4.6; 15 0.635,4.6; 16 -0.635,4.6; 17 -1.905,4.6; 18 -3.175,4.6; 19 -4.445,4.6; 20 -5.715,4.6
8-SOIC = smd 0.66 x 2.032: 1 -1.905,-3.073; 2 -0.635,-3.073; 3 0.635,-3.073; 4 1.905,-3.073; 5 1.905,3.073; 6 0.635,3.073; 7 -0.635,3.073; 8 -1.905,3.073
PLCC20 = smd 1.8 x 0.76: 1 -4.05,0; 2 -4.05,-1.27; 3 -4.05,-2.54; 9 4.05,-2.54; 10 4.05,-1.27; 11 4.05,0; 12 4.05,1.27; 13 4.05,2.54; 19 -4.05,2.54; 20 -4.05,1.27 | smd 0.76 x 1.8: 4 -2.54,-4.05; 5 -1.27,-4.05; 6 0,-4.05; 7 1.27,-4.05; 8 2.54,-4.05; 14 2.54,4.05; 15 1.27,4.05; 16 0,4.05; 17 -1.27,4.05; 18 -2.54,4.05
TQFP44_MC = smd 1.473 x 0.508: 1 -5.613,3.988; 2 -5.613,3.2; 3 -5.613,2.388; 4 -5.613,1.6; 5 -5.613,0.787; 6 -5.613,0; 7 -5.613,-0.787; 8 -5.613,-1.6; 9 -5.613,-2.388; 10 -5.613,-3.2; 11 -5.613,-3.988; 23 5.613,-3.988; 24 5.613,-3.2; 25 5.613,-2.388; 26 5.613,-1.6; 27 5.613,-0.787; 28 5.613,0; 29 5.613,0.787; 30 5.613,1.6; 31 5.613,2.388; 32 5.613,3.2; 33 5.613,3.988 | smd 0.508 x 1.473: 12 -3.988,-5.613; 13 -3.2,-5.613; 14 -2.388,-5.613; 15 -1.6,-5.613; 16 -0.787,-5.613; 17 0,-5.613; 18 0.787,-5.613; 19 1.6,-5.613; 20 2.388,-5.613; 21 3.2,-5.613; 22 3.988,-5.613; 34 3.988,5.613; 35 3.2,5.613; 36 2.388,5.613; 37 1.6,5.613; 38 0.787,5.613; 39 0,5.613; 40 -0.787,5.613; 41 -1.6,5.613; 42 -2.388,5.613; 43 -3.2,5.613; 44 -3.988,5.613
SOT23-6 = smd 0.6 x 0.9: 1 -0.95,-1.15; 2 0,-1.15; 3 0.95,-1.15; 4 0.95,1.15; 5 0,1.15; 6 -0.95,1.15
CHIPLED_0603 = smd 0.8 x 0.8: A 0,-0.75; C 0,0.75
22-23-2021 = drill 1 long: 1 -1.27,0; 2 1.27,0
TC26V = drill 0.813: 1 -1.27,0; 2 1.27,0
0603-RES = smd 1.1 x 1: 1 -0.85,0; 2 0.85,0
R2512 = smd 1.8 x 3.2: 1 -2.8,0; 2 2.8,0
SOT223 = smd 1.219 x 2.235: 1 -2.311,-3.099; 2 0,-3.099; 3 2.311,-3.099 | smd 3.6 x 2.2: 4 0,3.099
TESTPOINT = smd 3.81 x 2.032: P$1 0,0
22-23-2051 = drill 1 long: 1 -5.08,0; 2 -2.54,0; 3 0,0; 4 2.54,0; 5 5.08,0
22-23-2061 = drill 1 long: 1 -6.35,0; 2 -3.81,0; 3 -1.27,0; 4 1.27,0; 5 3.81,0; 6 6.35,0
AMP_227161 = drill 0.9 pad 1.27: 1 0,-5.08; 2 -2.54,-5.08 | hole 2: -5.08,0; 5.08,0
22-23-2031 = drill 1 long: 1 -2.54,0; 2 0,0; 3 2.54,0
22-23-2041 = drill 1 long: 1 -3.81,0; 2 -1.27,0; 3 1.27,0; 4 3.81,0

### Placement (x,y rotation side)
C1  68.2,30.23 180 top
C2  20.02,52.7 180 top
C3  106.55,28.83 90 top
C4  118.24,46.1 0 top
C5  18.81,60.39 270 top
C6  22.94,60.39 270 top
C7  118.36,53.09 0 top
C8  63.37,29.78 270 top
C9  11.98,51.4 0 top
C10  98.55,65.98 90 top
C11  88.07,65.98 90 top
C12  107.06,4.45 90 top
C13  39.19,54.8 0 top
C14  116.14,9.27 0 top
C15  50.91,43.32 180 top
C16  24.84,18.59 180 top
C17  11.66,43.4 0 top
C18  15.13,56.2 180 top
C19  90.81,44.45 90 top
C20  91.31,38.1 90 top
C21  90.93,16.83 90 top
C22  50.91,45.91 180 top
C23  90.87,26.73 90 top
C24  39.57,38.28 180 bottom
C25  25.5,30.62 270 top
C26  69.02,35.31 180 top
C27  62.24,54.67 0 top
C28  35,13.36 0 top
C29  34.8,17.68 0 top
C30  47.89,55.94 180 top
C31  86.23,9.4 90 top
C32  58.55,35.31 0 top
C33  58.55,38.66 0 top
C34  58.57,31.86 0 top
C35  58.55,41.88 0 top
C36  40.13,41.76 0 bottom
C37  68.15,61.15 90 top
C38  36.17,38.63 270 bottom
D1  46.75,61.85 180 top
D10  117.41,29.21 270 top
D11  114.62,32.83 270 top
D12  95.63,31.88 0 top
D13  117.41,36.39 270 top
D14  114.62,25.65 270 top
D15  111.89,29.34 270 top
D16  95.95,17.34 0 top
D17  111.89,22.16 270 top
D18  95.89,41.66 0 top
D19  109.09,25.84 270 top
D20  95.89,7.43 0 top
D21  109.09,18.67 270 top
IC1  93.22,63.5 180 top
IC2  89.92,35.12 270 top
IC3  20.02,55.94 180 top
IC4  70.05,55.24 0 top
IC5  76.39,30.86 90 top
IC6  56.34,55.31 90 top
IC7  89.53,41.4 270 top
IC8  89.53,23.62 270 top
IC9  89.66,13.72 270 top
IC10  54.67,34.35 270 top
IC11  12.1,53.68 90 top
IC12  24.83,16.45 270 top
IC13  11.72,45.75 90 top
IC14  32.4,56.07 180 top
IC15  54.67,37.71 270 top
IC16  54.7,30.98 270 top
IC17  54.67,40.93 270 top
IC18  39.57,41.72 0 top
IC19  83.82,9.59 180 top
IC22  31.25,12.43 270 top
IC23  31.23,16.73 270 top
IC25  25.5,34.05 180 top
LED1  85.53,67.82 180 top
LED2  102.36,37.15 270 top
LED3  102.49,46.93 270 top
LED4  102.49,22.67 270 top
LED5  102.49,12.76 270 top
LED6  80.71,23.62 270 top
LED7  81.53,4.19 0 top
LED8  37.41,62.1 270 top
LED10  106.36,62.42 270 top
Q1  48.35,44.59 90 top
R1  99.63,46.93 180 top
R2  99.57,37.15 180 top
R3  96.33,37.15 0 top
R4  16.48,13.6 90 top
R5  16.19,32.46 90 top
R6  20.04,16.46 0 top
R7  19.84,35.26 0 top
R8  21.35,60.39 90 top
R9  17.28,60.39 90 top
R10  15.19,60.39 90 top
R11  98.81,26.86 0 top
R12  68.2,31.47 180 top
R13  13.6,60.39 270 top
R14  77.98,5.59 90 top
R15  77.98,2.48 90 top
R16  96.33,46.93 0 top
R17  99.63,22.67 180 top
R18  63.37,32.89 90 top
R19  64.77,29.78 90 top
R20  96.39,22.67 0 top
R21  99.63,12.76 180 top
R22  85.53,64.39 90 top
R23  96.33,12.76 0 top
R24  99.25,2.41 0 top
R25  104.27,28 0 top
R26  104.9,3.56 0 top
R27  46.72,50.22 90 top
R28  83.88,27.69 0 top
R29  59.41,51.21 90 top
R30  62.24,55.94 180 top
R31  43.01,52.87 90 top
R32  109.79,62.42 180 top
R33  43.01,49.8 270 top
R34  8.04,54.64 0 top
R35  8.1,52.1 0 top
R36  8.1,46.7 0 top
R37  23.15,31.32 90 top
R38  23.15,28.21 90 top
R39  49.73,60.77 0 top
R40  46.72,47.17 90 top
R41  8.04,44.16 0 top
R44  23.15,34.37 90 top
R45  34.56,62.1 180 top
T1  101.85,42.86 270 top
T2  101.85,33.08 270 top
T3  101.92,18.61 270 top
T4  101.92,8.64 270 top
TP1  86.55,58.93 0 top
TP2  113.28,67.06 270 top
TP3  103.95,67.18 90 top
X1  17.79,66.67 0 top
X2  122.56,30.54 270 top
X3  7.15,13.47 90 top
X4  7.26,32.46 90 top
X5  39.19,29.21 180 top
X6  108.65,67.31 0 top
X7  33.79,66.67 180 top
X8  3.15,52.1 270 top
X10  3.15,44.16 270 top
X12  56.65,65.41 180 top

### Tracks (layer width: path | path; a pad name or v marks a point on that pad's centre or on a via)
1HZ  (via drill 0.6)
  Top 0.406: R30.2 IC6.3 v57.48,55.94 | IC18.36 v41.96,45.34
  Bottom 0.406: v41.96,45.34 44.78,45.34 44.78,50.95 57.48,50.95 v57.48,55.94
3.3V
  Top 0.406: IC3.10 IC3.11 | IC3.11 17.3,57.21 17.29,57.21 | IC3.11 19.38,56.9 21.29,54.99 | 21.29,54.99 IC3.3 | 21.29,54.99 21.29,54.23 20.84,53.78 20.84,52.73 C2.1
32KHZ  (via drill 0.6)
  Top 0.406: R29.2 IC6.1 61.23,53.4 v61.23,52.09 | v38.11,57.34 IC14.2
  Bottom 0.406: v61.23,52.09 61.23,59.63 38.11,59.63 v38.11,57.34
!INH1  (via drill 0.5)
  Top 0.406: IC2.2 v86.04,35.12 | v86.04,30.23 IC5.5 | IC7.2 v86.04,41.4
  Bottom 0.406: v86.04,30.23 v86.04,35.12 v86.04,41.4
!INH2  (via drill 0.5)
  Top 0.305: IC5.8 v78.93,34.04 | v78.93,22.04 84.77,22.04 85.34,22.61 v85.34,23.62
  Top 0.406: IC8.2 v85.34,23.62 | v85.34,13.72 IC9.2
  Bottom 0.305: v78.93,34.04 v78.93,22.04
  Bottom 0.406: v85.34,23.62 v85.34,13.72
!READ_COUNTER  (via drill 0.6)
  Top 0.406: IC18.42 37.19,49.73 v32.64,49.73 | v32.64,58.12 34.94,58.12 IC14.4
  Bottom 0.406: v32.64,49.73 v32.64,58.12
!RESET_COUNTER  (via drill 0.6)
  Top 0.406: IC18.43 36.37,48.64 v31.14,48.64 | v31.14,55.3 IC14.7
  Bottom 0.406: v31.14,48.64 v31.14,55.3
!RESET_DRIVE
  Top 0.406: IC18.20 41.96,33.15 48.06,33.15 48.06,23.62 71.79,23.62 IC5.20
+5V  (via drill 0.6)
  Top 0.406: IC3.12 16.04,56.26 C18.1 | IC7.5 90.83,43.57 C19.1 | IC13.5 10.42,43.4 C17.1 | C9.1 10.8,51.4 IC11.5 | IC18.7 36.17,40.93 v36.17,40.82 | IC18.28 42.29,41.72 v42.29,41.76
  Bottom 0.406: v36.17,40.82 C38.1 | v42.29,41.76 C36.1
  pour Top (isolate 0.203): 1.27,74.93 92.65,74.87 92.65,1.27 1.27,1.27
+V
  Top 0.406: LED10.A 105.09,62.42
  pour Top (isolate 0.203): 93.98,74.93 125.73,74.93 125.67,1.21 93.92,1.21
A  (via drill 0.5)
  Top 0.406: IC7.1 85.66,42.35 v83.25,42.35 | v83.25,28.96 IC5.4
  Bottom 0.406: v83.25,42.35 v83.25,28.96
B  (via drill 0.5)
  Top 0.406: IC2.1 v84.77,36.07 | v84.77,31.5 IC5.6
  Bottom 0.406: v84.77,36.07 v84.77,31.5
BUS_CONTROL  (via drill 0.6)
  Top 0.406: IC18.25 45.19,39.34 43.38,39.34 v43.38,40.69 | v51.89,41.88 IC17.1 54.69,41.88 54.69,38.66 | 54.69,38.66 IC15.1 | IC10.1 54.69,35.3 | 54.69,35.3 54.69,38.66 | IC16.1 54.69,31.93 54.69,35.3
  Bottom 0.406: v43.38,40.69 43.38,41.88 v51.89,41.88
C  (via drill 0.5)
  Top 0.305: IC5.7 v87.19,32.77 | v88.2,25.59 88.2,24.62 IC8.1
  Bottom 0.406: v87.19,32.77 87.82,32.77 88.2,32.45 v88.2,25.59
CNTRL  (via drill 0.6)
  Top 0.406: IC18.21 42.77,33.93 48.79,33.93 48.79,25.5 v69.37,25.5 | v69.37,36.6 71.79,36.6 IC5.11
  Bottom 0.406: v69.37,25.5 v69.37,36.6
COUNT_CCW  (via drill 0.6)
  Top 0.406: IC18.24 v47.83,38.52 v47.83,38.51 | v47.83,11.48 IC22.4
  Bottom 0.406: v47.83,38.51 v47.83,11.48
COUNT_CW  (via drill 0.6)
  Top 0.406: IC18.15 37.97,33.96 34.04,33.96 34.04,22.55 v34.01,22.55 | v33.98,15.77 v33.98,15.78 IC23.4
  Bottom 0.406: v34.01,22.55 34.01,15.77 v33.98,15.77
CW/!CCW  (via drill 0.6)
  Top 0.406: IC5.17 71.83,28.93 v66.93,28.93 | v60.68,30.02 IC16.4 | IC17.4 62.1,39.98 v62.1,39.95
  Bottom 0.406: v66.93,28.93 62.05,28.93 | 62.05,28.93 60.68,28.93 v60.68,30.02 | v62.1,39.95 62.05,39.95 62.05,28.93
D  (via drill 0.5)
  Top 0.406: IC5.9 v77.79,35.31 | v77.79,14.67 IC9.1
  Bottom 0.406: v77.79,35.31 v77.79,14.67
D0  (via drill 0.6)
  Top 0.406: IC14.1 34.04,56.07 v34.04,53.85 | v40.36,45.41 IC18.38
  Bottom 0.406: v34.04,53.85 34.04,45.41 v40.36,45.41
D1
  Top 0.406: IC14.19 39.57,53.53 IC18.39
D2
  Top 0.406: IC14.18 38.79,52.02 IC18.40
D3
  Top 0.406: IC14.17 33.68,50.47 37.97,50.47 IC18.41
D4
  Top 0.406: IC14.14 29.84,52.02 29.84,44.91 33.96,44.91 IC18.2
D5
  Top 0.406: IC14.13 28.35,44.09 33.96,44.09 IC18.3
D6
  Top 0.406: IC14.12 26.7,54.8 26.7,43.33 33.96,43.33 IC18.4
D7
  Top 0.406: IC14.11 25.68,56.07 25.68,42.49 33.96,42.49 IC18.5
D+
  Top 0.406: C6.1 R8.2 21.35,61.91 17.79,65.47 X1.3
D-
  Top 0.406: C5.1 R9.2 17.29,62.55 15.25,64.58 X1.2
DATA_SELECT  (via drill 0.6)
  Top 0.406: IC14.3 39.67,58.61 v39.67,57.25 | v41.17,49.55 IC18.37
  Bottom 0.406: v39.67,57.25 39.67,49.55 v41.17,49.55
ENABLE_DRIVE  (via drill 0.6)
  Top 0.406: IC5.10 v76.71,36.58 | IC19.1 IC19.2 83.82,13.14 v76.71,13.14 | IC18.19 41.17,32.44 47.04,32.44 47.02,22.33 v76.71,22.33
  Bottom 0.406: v76.71,36.58 v76.71,22.33 v76.71,13.14
EXT_DIRECTION  (via drill 0.6)
  Top 0.406: IC12.2 20.89,16.45 R6.2 20.9,16.46 v20.9,20.4 | IC18.14 37.19,34.82 v29.92,34.82 | IC23.1 29.94,20.4 v29.92,20.4 29.97,20.34 v54.74,20.34 | IC16.2 54.74,30.98 v54.74,27.71
  Bottom 0.406: v29.92,34.82 v29.92,20.4 v20.9,20.4 | v54.74,27.71 v54.74,20.34
EXT_TRIGGER  (via drill 0.6)
  Top 0.406: 26.47,37.73 IC18.11 31.88,37.73 v31.88,36.45 | 26.47,37.73 20.69,37.73 R7.2 | IC25.1 26.47,35.2 26.47,37.73 | IC10.2 53.38,34.37 50.49,34.37 50.49,36.47 v46.56,36.47
  Bottom 0.406: v46.56,36.47 34.04,36.45 v31.88,36.45
GND  (via drill 0.5, 0.5 pad 1.02, 0.6)
  Top 0.305: IC14.10 v30.11,57.34
  Top 0.406: C5.2 v18.81,58.29 | C6.2 v24.59,59.5 | R22.1 v85.53,62.29 88.08,62.29 C11.C | R32.1 v112.27,62.42 | IC3.13 19,55.63 v19,54.67 19,52.83 19.13,52.7 C2.2 | R13.1 v13.6,62.74 | IC3.5 21.86,56.26 v21.03,57.09 | LED2.C v104.27,37.15 | LED3.C v104.39,46.93 | LED4.C v104.46,22.67 | LED5.C v104.39,12.76 | C19.2 v90.81,46.8 | IC7.3 v89.53,40.45 | C20.2 v92.52,38.99 | C21.2 v90.93,19.05 | C23.2 v90.87,28.83 | v89.47,22.67 IC8.3 v86.81,22.67 | IC9.3 v89.66,12.77 v89.66,12.76 | IC2.3 v89.91,34.17 v89.92,34.16 | IC5.2 v86.81,26.42 | C1.2 v65.98,30.23 65.98,28.93 R19.1 C8.2 | C3.2 105.18,29.68 v105.16,29.65 | C27.2 v64.45,54.67 | C26.2 v66.93,35.31 | IC6.5 53.26,58.46 v53.29,58.48 | LED8.C v39.38,62.1 | LED6.C v82.8,23.62 | C12.2 105.82,5.29 v105.79,5.27 | C9.2 v14.07,51.4 | IC11.3 v12.11,54.63 v12.1,54.63 | IC13.3 11.66,46.7 v11.72,46.7 | C22.1 C15.1 51.74,43.37 v51.74,44.64 | C13.2 v41.35,54.8 | C32.2 v60.71,35.31 | C33.2 v60.71,38.66 | C35.2 v60.71,41.88 | C34.2 v60.73,31.86 | C17.2 v13.82,43.4 | C18.2 v12.9,56.2 | IC19.3 81.47,10.88 v81.47,10.86 | C31.2 v87.57,10.29 | IC15.3 v52.13,36.75 | IC10.3 v52.13,33.4 | IC16.3 v52.16,30.02 | IC17.3 v52.13,39.98 | IC4.2 IC4.1 66.37,52.65 v66.37,52.7 | IC4.7 IC4.2 | IC4.4 71.96,50.23 69.42,50.23 IC4.2 | C37.2 v68.15,63.37 | IC18.29 43.54,42.51 v43.54,43.05 | IC18.6 35.94,41.72 v35.94,42.75 | R4.1 12.23,10.8 X3.2 | C16.2 v22.45,18.59 | IC12.3 v22.23,15.5 v22.23,15.49 | R38.1 25.5,27.36 v25.5,27.41 C25.2 | R44.1 23.19,33.52 23.19,33.98 25.5,33.98 IC25.2 25.5,36.7 v24.82,36.7 | C29.2 35.65,17.65 v37.13,17.65 | C28.2 35.85,13.39 v37.34,13.39 | IC23.3 29.94,15.75 v31.22,15.75 | IC22.3 29.96,11.51 v31.27,11.51 | R15.1 79.68,1.63 v79.68,1.73
  Top 0.61: R5.1 16.19,29.92 X4.2
  Top 1.016: C10.C 98.55,60.96 v95,60.96 v93.73,60.96 93.22,60.96 IC1.3 | D10.A 117.41,26.42 117.47,26.35 v115.25,26.35 | R24.1 v98.42,2.41 | R11.1 v97.98,26.86 | C7.C v115.25,53.09 | C4.- v117.92,46.1 | D14.A 116.58,23.1 v116.59,23.11 | D17.A 114.04,19.61 v114.05,19.62 | D21.A 111.18,16.12 v111.19,16.13 | TP2.P$1 v115.38,67.06
  Bottom 0.406: v86.81,26.42 v86.81,22.67
  other vias: 91.19,63.5 92.46,63.5 93.73,63.5 95,63.5 91.19,62.23 92.46,62.23 93.73,62.23 95,62.23 92.46,60.96 91.19,60.96 91.19,59.69 92.46,59.69 93.73,59.69 95,59.69 91.19,58.42 92.46,58.42 93.73,58.42 95,58.42
  pour Bottom (isolate 0.203): 1.27,74.93 125.73,74.93 125.67,1.21 1.27,1.27
HALF/!FULL
  Top 0.406: IC5.19 49.51,26.42 49.51,34.87 43.56,34.87 IC18.22
I2C_CLK
  Top 0.406: 56.66,67.69 56.66,60 56.21,59.55 56.21,53.4 IC6.8 53.26,49.37 R27.1 R40.2 | 56.66,67.69 52.84,67.69 X12.4 | IC4.6 70.69,67.69 56.66,67.69
I2C_DATA  (via drill 0.6)
  Top 0.406: X12.3 55.38,54.67 IC6.7 51.58,54.67 51.58,52.63 43.02,52.63 R31.1 R33.1 | IC4.5 72.02,57.84 v72.02,69.15
  Bottom 0.406: v72.02,69.15 55.38,69.15 X12.3
ILLUMINATE  (via drill 0.6)
  Top 0.406: IC13.2 IC13.1 | IC11.2 IC11.1 v12.1,52.73 | v11.72,44.79 IC13.1 | IC13.1 19.38,44.8 19.38,38.51 33.96,38.51 IC18.10
  Bottom 0.406: v12.1,52.73 9.94,52.73 9.94,44.79 v11.72,44.79
LED1
  Top 0.406: R22.2 LED1.C
LED5
  Top 0.406: LED10.C R32.2
LEFT  (via drill 0.6)
  Top 0.406: IC18.9 20.55,39.33 v20.55,39.98 | v8.89,39.98 R41.2
  Bottom 0.406: v20.55,39.98 v8.89,39.98
N$1
  Top 0.406: R39.1 46.77,60.77
  Top 0.61: 46.77,60.77 D1.3
N$2
  Top 0.406: R5.2 R7.1
  Top 0.61: R5.2 16.19,32.46 X4.1
N$3
  Top 0.406: R4.2 18.88,16.4 R6.1
  Top 0.61: R4.2 16.48,13.47 X3.1
N$4
  Top 0.406: C15.2 Q1.1 IC18.30
N$5
  Top 0.406: LED2.A R2.1
N$6
  Top 0.406: IC3.9 17.29,58.17 R9.1
N$8
  Top 0.406: IC3.8 21.35,58.17 R8.1
N$10
  Top 0.406: C22.2 Q1.2 48.35,44.7 47.45,44.7 47.45,44.11 IC18.31
N$11
  Top 0.406: D12.3 95.63,34.29 96.74,35.4 T2.1 98.75,37.11 R2.2 R3.2
N$12  (via drill 0.6)
  Top 0.406: IC18.23 43.2,37.73 v43.2,38.2
  Bottom 0.406: v43.2,38.2 41,38.2 C24.A
N$13  (via drill 0.5)
  Top 0.406: R13.2 R10.1 v15.19,58.04 | v15.19,54.36 IC3.15
  Bottom 0.406: v15.19,58.04 v15.19,54.36
N$14
  Top 0.406: R3.1 94.61,37.15 91.82,34.17 IC2.4
N$15
  Top 0.406: IC6.6 C30.+ | R39.2 50.58,55.97
  Top 0.61: 50.58,55.97 C30.+
N$16
  Top 0.406: R17.1 LED4.A
N$20
  Top 0.406: IC18.35 42.77,48.95 R33.2
N$21
  Top 0.406: D16.3 95.95,19.81 97.03,20.89 98.79,20.89 T3.1 98.78,20.95 R17.2 R20.2
N$22
  Top 0.406: R20.1 IC8.4
N$23
  Top 0.406: R28.1 IC5.3 79.12,27.69 79.12,23.62 LED6.A
N$24
  Top 0.406: R21.1 LED5.A
N$25
  Top 0.406: R34.1 X8.1
N$26
  Top 0.406: D20.3 95.89,9.65 97.22,10.99 98.78,10.99 T4.1 98.78,10.98 R21.2 R23.2
N$27
  Top 0.406: R23.1 IC9.4
N$28
  Top 0.406: D18.3 95.89,44.01 97.03,45.15 98.73,45.15 T1.1 98.78,45.2 R1.2 R16.2
N$30
  Top 0.406: R38.2 R37.1 23.15,30.45 24.21,30.45 24.21,32.9 IC25.4
N$31
  Top 0.406: LED3.A R1.1
N$33
  Top 0.406: R16.1 94.55,46.93 94.55,43.56 91.44,40.45 IC7.4 91.06,40.45
N$38
  Top 0.406: IC11.4 8.94,54.63 R34.2
N$39
  Top 0.406: R35.1 X8.2
N$40
  Top 0.406: R36.1 X10.1
N$41
  Top 0.406: IC13.4 9.01,46.7 R36.2
N$42
  Top 0.406: X10.2 R41.1
N$43
  Top 0.406: IC18.32 46.72,44.92 R40.1
N$47
  Top 0.406: R15.2 R14.1 80.26,4.75 LED7.1
N$48
  Top 0.406: R45.1 LED8.A
N$49
  Top 0.406: IC14.5 R45.2
N$52
  Top 0.406: IC19.4 82.8,8.29 LED7.2
N$53
  Top 0.406: R44.2 23.15,35.2 IC25.3
N$54  (via drill 0.6)
  Top 0.406: IC22.1 29.92,13.38 v29.92,14.53 | v27.43,14.5 26.13,14.5 IC12.4
  Bottom 0.406: v29.92,14.53 27.43,14.53 v27.43,14.5
N$101  (via drill 0.6)
  Top 0.406: IC23.2 28.63,16.73 | 28.63,16.73 28.63,12.45 29.96,12.45 IC22.2 | IC25.6 28.04,32.9 v28.04,32.92 | v27.99,21.64 27.99,16.73 28.63,16.73
  Bottom 0.406: v28.04,32.92 27.99,32.92 v27.99,21.64
OSC
  Top 0.406: IC5.16 C1.1 R12.1
OUTA
  Top 1.016: X2.3 122.5,31.76 D10.C D13.A 117.23,33.66 111.63,33.66 106.54,42.81 T1.4
  Top 1.27: T1.2 T1.4
OUTB
  Top 1.016: X2.4 122.49,29.21 114.68,29.21 114.62,29.15 D14.C D11.A 114.54,30.23 109.67,30.23 105.98,33.08 T2.4
  Top 1.27: T2.2 T2.4
OUTC
  Top 0.406: 114.43,24.83 112.08,24.83 112,24.83 D17.C
  Top 1.016: D15.A 111.89,25.78 | 111.89,25.27 112.08,25.08 112.08,24.83 118.94,24.83 120.65,26.73 X2.5 | D17.C 111.89,25.78 | 111.89,25.78 107.44,25.78 106.36,24.7 106.36,20.13 T3.4
  Top 1.27: T3.2 T3.4
OUTD
  Top 1.016: D19.A D21.C | D21.C 109.09,19.18 106.93,17.34 106.93,9.65 105.92,8.64 T4.4 | X2.6 120.59,24.19 117.6,21.34 109.1,21.34 D21.C
  Top 1.27: T4.2 T4.4
PGC(ICSPCLK)
  Top 0.406: X5.5 35.38,33.05 38.79,33.05 IC18.16
PGD(ICSPDAT)
  Top 0.406: X5.4 37.92,32.18 39.57,32.18 IC18.17
PIC_DIRECTION
  Top 0.406: IC18.27 IC17.2
PIC_STEP
  Top 0.406: IC18.26 49.58,40.12 49.58,37.72 IC15.2
QA
  Top 0.406: X7.3 33.8,64.01 28.33,64.01 28.33,58.61 IC14.9
QB
  Top 0.406: X7.1 38.88,63.18 29.86,63.18 IC14.8
RIGHT
  Top 0.406: IC18.8 21.54,40.12 21.57,49.12 8.95,49.15 R35.2
RX  (via drill 0.6)
  Top 0.406: IC18.1 32.72,45.72 32.72,45.9 v31.04,45.9 | v22.73,45.9 IC3.1
  Bottom 0.406: v31.04,45.9 v22.73,45.9
SEN_1  (via drill 0.5)
  Top 0.406: D18.1 94.94,39.62 95.57,38.99 98.17,38.99 98.74,39.56 98.74,40.54 T1.3 | D12.1 94.68,29.46 95.31,29.08 98.17,29.08 98.74,29.65 98.74,30.76 T2.3 | R25.1 101.67,28 101.61,27.94
  Top 1.016: T2.3 101.31,30.77 v101.41,30.67 101.54,30.54 | 101.54,30.54 101.54,26.93 R11.2 101.61,27.94 101.61,30.47 101.54,30.54 | v101.41,40.51 98.79,40.51 T1.3
  Bottom 1.016: v101.41,30.67 v101.41,40.51
SEN_2  (via drill 0.5)
  Top 0.406: D16.1 95,15.17 96.01,14.41 97.92,14.41 98.81,15.18 98.81,16.28 T3.3 | D20.1 94.94,5.33 95.63,4.64 97.92,4.64 98.87,5.59 98.87,6.27 T4.3 | R26.1 102.11,3.56 102.05,3.49
  Top 1.016: T4.3 101.44,6.33 101.98,5.78 101.98,2.48 R24.2 102.05,3.49 102.05,5.77 v101.66,6.16 | v101.66,16.32 98.84,16.32 T3.3
  Bottom 1.016: v101.66,6.16 v101.66,16.32
SENSE1  (via drill 0.6)
  Top 0.406: C3.1 106.53,28 R25.2 105.12,26.19 103.31,24.38 95.25,24.38 93.34,26.29 v93.34,34.29 | v89.41,37.59 84.14,37.59 v81.79,39.94 | v74.68,39.94 74.68,33.21 74.11,32.77 IC5.14
  Bottom 0.406: v93.34,34.29 92.71,34.29 v89.41,37.59 | v81.79,39.94 v74.68,39.94
SENSE2  (via drill 0.5)
  Top 0.406: C12.1 105.79,3.6 | 105.79,3.6 R26.2 | 105.79,3.6 v105.79,1.33 | v73.66,34.04 IC5.13
  Bottom 0.406: v105.79,1.33 89.09,1.33 89.09,11.81 75.63,11.81 75.63,32.58 v73.66,34.04
STEP  (via drill 0.6)
  Top 0.406: IC5.18 v58.14,27.69 | v58.14,33.4 IC10.4 | IC15.4 v57.58,36.75
  Bottom 0.406: v58.14,27.69 v58.14,33.4 58.14,36.73 v57.58,36.75
TX  (via drill 0.6)
  Top 0.406: IC18.44 30.99,47.33 v30.99,47.32 | v24.54,47.35 24.54,55.63 IC3.4
  Bottom 0.406: v30.99,47.32 24.54,47.32 v24.54,47.35
VBUS
  Top 0.406: 15.25,61.29 R10.2 15.19,63.25 13.47,64.96 12.71,64.96 X1.1
VPP/!MCLR
  Top 0.406: X5.1 45.54,31.75 40.36,31.75 IC18.18
VREF  (via drill 0.6)
  Top 0.406: R18.1 C8.1 R19.2 v64.77,33.05 | IC5.15 70.16,31.5 70.16,33.05 v67.69,33.05
  Bottom 0.406: v64.77,33.05 v67.69,33.05

### Text on the board
tNames: INDEX | vbus | USB | LCD | D- | gnd | GND | QA | +5V | QB | DATA | D+ | CLK | GND | +5V | POWER | 12V | GND | 5V | LED | CCM_0001 / Unipolar Stepper Motor Controller / Rev A / Dec 2014 / N. Fitch | RTN | GND | RIGHT | LEFT | MOTOR | Trigger | LVP | CLK | GND | +5V | DATA | !MCLR! | Direction (CW/!CCW!) | +12V | +12V | A | B | C | D | RA
tValues: AMT102 | PROG | Motor Enabled